# Altium project Connections.PrjPcb
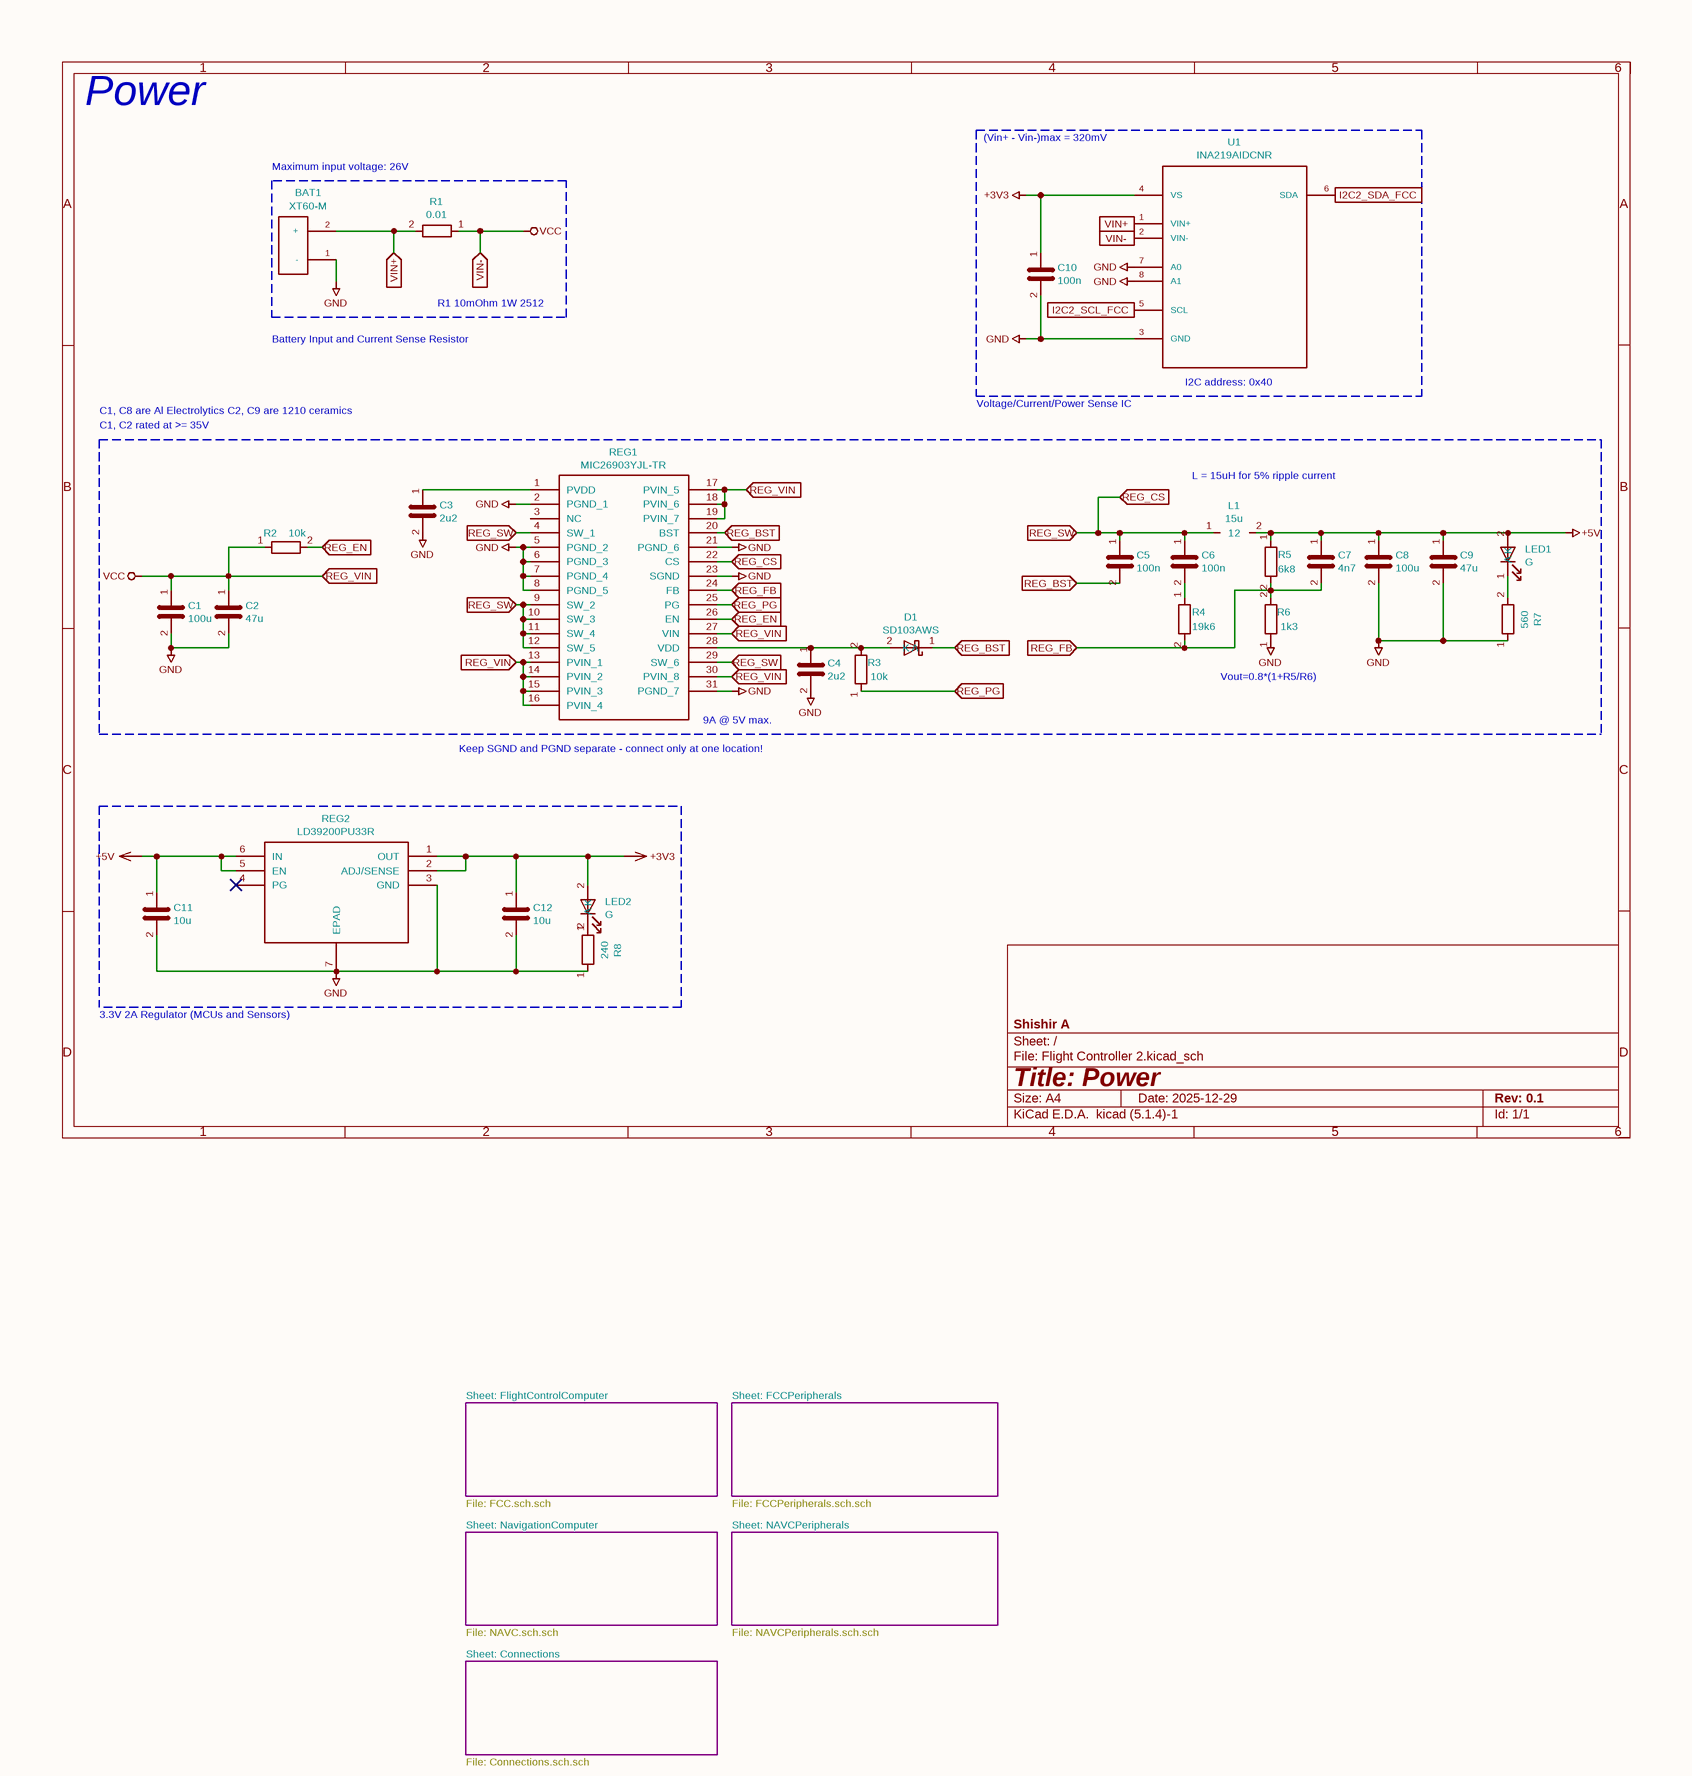
[diagram p0: Flight Controller 2.SchDoc]
6 sheets, 208 parts. Net scope: flat (ports and power ports of the same name join across sheets).
Sheets:
  Flight Controller 2.SchDoc
    FlightControlComputer = FCC.SchDoc
    NAVCPeripherals = NAVCPeripherals.SchDoc
    Connections = Connections.SchDoc
    FCCPeripherals = FCCPeripherals.SchDoc
    NavigationComputer = NAVC.SchDoc

## Sheet Flight Controller 2.SchDoc
size 297 x 209 mm

### Parts
BAT1  XT60-M  [AMASS_XT60-M]
C1  100u  [C_Elec_6.3x7.7]
C2  47u  [C_1210_3225Metric]
C3  2u2  [C_0805_2012Metric]
C4  2u2  [C_0805_2012Metric]
C5  100n  [C_0805_2012Metric]
C6  100n  [C_0805_2012Metric]
C7  4n7  [C_0805_2012Metric]
C8  100u  [C_Elec_6.3x7.7]
C9  47u  [C_1210_3225Metric]
C10  100n  [C_0402_1005Metric]
C11  10u  [C_0603_1608Metric]
C12  10u  [C_0603_1608Metric]
D1  SD103AWS  [D_SOD-323]
L1  15u  [INDPM135125X650N]
LED1  G  [LED_0603_1608Metric]
LED2  G  [LED_0603_1608Metric]
R1  0.01  [R_2512_6332Metric]
R2  10k  [R_0805_2012Metric]
R3  10k  [R_0805_2012Metric]
R4  19k6  [R_0805_2012Metric]
R5  6k8  [R_0805_2012Metric]
R6  1k3  [R_0805_2012Metric]
R7  560  [R_0603_1608Metric]
R8  240  [R_0603_1608Metric]
REG1  MIC26903YJL-TR  [MIC24054YJLTR]
REG2  LD39200PU33R  [SON95P300X300X100-7N-D]
U1  INA219AIDCNR  [SOT65P280X145-8N]

### Sub-sheets
Connections = Connections.SchDoc: no entries
FCCPeripherals = FCCPeripherals.SchDoc: no entries
FlightControlComputer = FCC.SchDoc: no entries
NAVCPeripherals = NAVCPeripherals.SchDoc: no entries
NavigationComputer = NAVC.SchDoc: no entries

### Ports
I2C2_SCL_FCC (in), I2C2_SDA_FCC (in), REG_BST (in), REG_CS (in), REG_EN (in), REG_FB (in), REG_PG (in), REG_SW (in), REG_VIN (in), VIN+ (in), VIN- (in)

### Nets
+3V3: C10.1 C12.1 LED2.2(A) REG2.1(OUT) REG2.2(ADJ/SENSE) U1.4(VS)
+5V: C7.1 C8.1 C9.1 C11.1 L1.2 LED1.2(A) R5.1 REG2.5(EN) REG2.6(IN)
GND: BAT1.1(-) C1.2 C2.2 C3.2 C4.2 C8.2 C9.2 C10.2 C11.2 C12.2 R6.1 R7.1 R8.1 REG1.2(PGND_1) REG1.5(PGND_2) REG1.6(PGND_3) REG1.7(PGND_4) REG1.8(PGND_5) REG1.21(PGND_6) REG1.23(SGND) REG1.31(PGND_7) REG2.3(GND) REG2.7(EPAD) U1.3(GND) U1.6(SDA) U1.7(A0) U1.8(A1) ; port I2C2_SDA_FCC
VCC: C1.1 C2.1 R1.1 R2.1 REG1.13(PVIN_1) REG1.14(PVIN_2) REG1.15(PVIN_3) REG1.16(PVIN_4) REG1.17(PVIN_5) REG1.18(PVIN_6) REG1.19(PVIN_7) REG1.27(VIN) REG1.30(PVIN_8) U1.2(VIN-) ; port REG_VIN, port VIN-
I2C2_SCL_FCC: U1.5(SCL) ; port I2C2_SCL_FCC
REG_BST: C5.2 D1.1(K) REG1.20(BST) ; port REG_BST
REG_CS: C5.1 C6.1 L1.1 REG1.4(SW_1) REG1.9(SW_2) REG1.10(SW_3) REG1.11(SW_4) REG1.12(SW_5) REG1.22(CS) REG1.29(SW_6) ; port REG_SW, port REG_CS
REG_EN: R2.2 REG1.26(EN) ; port REG_EN
REG_FB: C7.2 R4.2 R5.2 R6.2 REG1.24(FB) ; port REG_FB
REG_PG: R3.1 REG1.25(PG) ; port REG_PG
VIN+: BAT1.2(+) R1.2 U1.1(VIN+) ; port VIN+
NetC3_1: C3.1 REG1.1(PVDD)
NetC4_1: C4.1 D1.2(A) R3.2 REG1.28(VDD)
NetC6_2: C6.2 R4.1
NetLED1_1: LED1.1(K) R7.2
NetLED2_1: LED2.1(K) R8.2

Not connected (* = marked no-connect by the designer): REG1 3(NC); REG2 4(PG)*

### Notes on the sheet
- Power
- (Vin+ - Vin-)max = 320mV
- Maximum input voltage: 26V
- Battery Input and
  Current Sense Resistor
- R1 10mOhm 1W 2512
- C1, C8 are Al Electrolytics
  C2, C9 are 1210 ceramics
- C1, C2 rated at >= 35V
- Voltage/Current/Power Sense IC
- (near U1) I2C address: 0x40
- L = 15uH for 5% ripple current
- Vout=0.8*(1+R5/R6)
- (near REG1) Keep SGND and PGND separate - connect only at one location!
- (near REG1) 9A @ 5V max.
- 3.3V 2A Regulator (MCUs and Sensors)
- Sheet: FlightControlComputer
- Sheet: FCCPeripherals
- File: FCC.sch.sch
- File: FCCPeripherals.sch.sch
- Sheet: NavigationComputer
- Sheet: NAVCPeripherals
- Sheet: Connections
- File: NAVC.sch.sch
- File: NAVCPeripherals.sch.sch
- File: Connections.sch.sch
- 1
- 2
- 3
- 4
- 5
- 6
- A
- B
- C
- D
- Title: Power
- File: Flight Controller 2.kicad_sch
- Sheet: /
- Shishir A
- KiCad E.D.A.  kicad (5.1.4)-1
- Size: A4
- Date: 2025-12-29
- Rev: 0.1
- Id: 1/1

### Library data of the parts
BAT1 = XT60-M_2: Field4: None; Field6: Unavailable; Field7: AMASS; Field5: XT60-M; Value: XT60-M; Footprint: XT60-M:AMASS_XT60-M
C1-C12 = C
  C1: Value: 100u; Footprint: Capacitor_SMD:C_Elec_6.3x7.7; Supplier 1: DigiKey; Supplier Part Number 1: P124788CT-ND
  C2: Value: 47u; Footprint: Capacitor_SMD:C_1210_3225Metric; Supplier 1: DigiKey; Supplier Part Number 1: 587-6141-1-ND
  C3 C4: Value: 2u2; Footprint: Capacitor_SMD:C_0805_2012Metric
  C5 C6: Value: 100n; Footprint: Capacitor_SMD:C_0805_2012Metric
  C7: Value: 4n7; Footprint: Capacitor_SMD:C_0805_2012Metric
  C8: Value: 100u; Footprint: Capacitor_SMD:C_Elec_6.3x7.7
  C9: Value: 47u; Footprint: Capacitor_SMD:C_1210_3225Metric
  C10: Value: 100n; Footprint: Capacitor_SMD:C_0402_1005Metric
  C11 C12: Value: 10u; Footprint: Capacitor_SMD:C_0603_1608Metric
D1 = D_Schottky: Value: SD103AWS; Footprint: Diode_SMD:D_SOD-323
L1 = L: Value: 15u; Footprint: SRP1265A-150M:INDPM135125X650N; Supplier: DigiKey; Supplier Part Number: SRP1265A-150MCT-ND; Supplier 1: DigiKey; Supplier Part Number 1: SRP1265A-150MCT-ND
LED1 LED2 = LED: Value: G; Footprint: LED_SMD:LED_0603_1608Metric
R1-R8 = R
  R1: Value: 0.01; Footprint: Resistor_SMD:R_2512_6332Metric
  R2 R3: Value: 10k; Footprint: Resistor_SMD:R_0805_2012Metric
  R4: Value: 19k6; Footprint: Resistor_SMD:R_0805_2012Metric
  R5: Value: 6k8; Footprint: Resistor_SMD:R_0805_2012Metric
  R6: Value: 1k3; Footprint: Resistor_SMD:R_0805_2012Metric
  R7: Value: 560; Footprint: Resistor_SMD:R_0603_1608Metric
  R8: Value: 240; Footprint: Resistor_SMD:R_0603_1608Metric
REG1 = MIC26903YJL-TR: Manufacturer_Name: Micrel; Description: Switching Voltage Regulators 28V, 9A HyperLight Load  Synchronous DC/DC Buck Regulator SuperSwitcher IIG; Height: 2; Manufacturer_Part_Number: MIC26903YJL-TR; Mouser Part Number: 998-MIC26903YJLTR; Mouser Price/Stock: https://www.mouser.com/Search/Refine.aspx?Keyword=998-MIC26903YJLTR; Value: MIC26903YJL-TR; Footprint: MIC26903YJL-TR:MIC24054YJLTR
REG2 = LD39200PU33R: Manufacturer_Name: STMicroelectronics; Description: LDO Voltage Regulators 2 A high PSRR ultra low drop linear regulator with reverse current protection; Height: 1; Manufacturer_Part_Number: LD39200PU33R; Mouser Part Number: 511-LD39200PU33R; Mouser Price/Stock: https://www.mouser.com/Search/Refine.aspx?Keyword=511-LD39200PU33R; Value: LD39200PU33R; Footprint: LD39200PU33R:SON95P300X300X100-7N-D
U1 = INA219AIDCNR_2: Field4: 26-V, Bi-Directional, Zero-Drift, High-Side, I2C Out Current/Power Monitor 8-SOT-23 -40 to 125; Field5: Texas Instruments; Field6: SOT-23 Texas Instruments; Field7: None; Field8: INA219AIDCNR; Value: INA219AIDCNR; Footprint: INA219AIDCNR:SOT65P280X145-8N

## Sheet FCC.SchDoc
size 297 x 209 mm
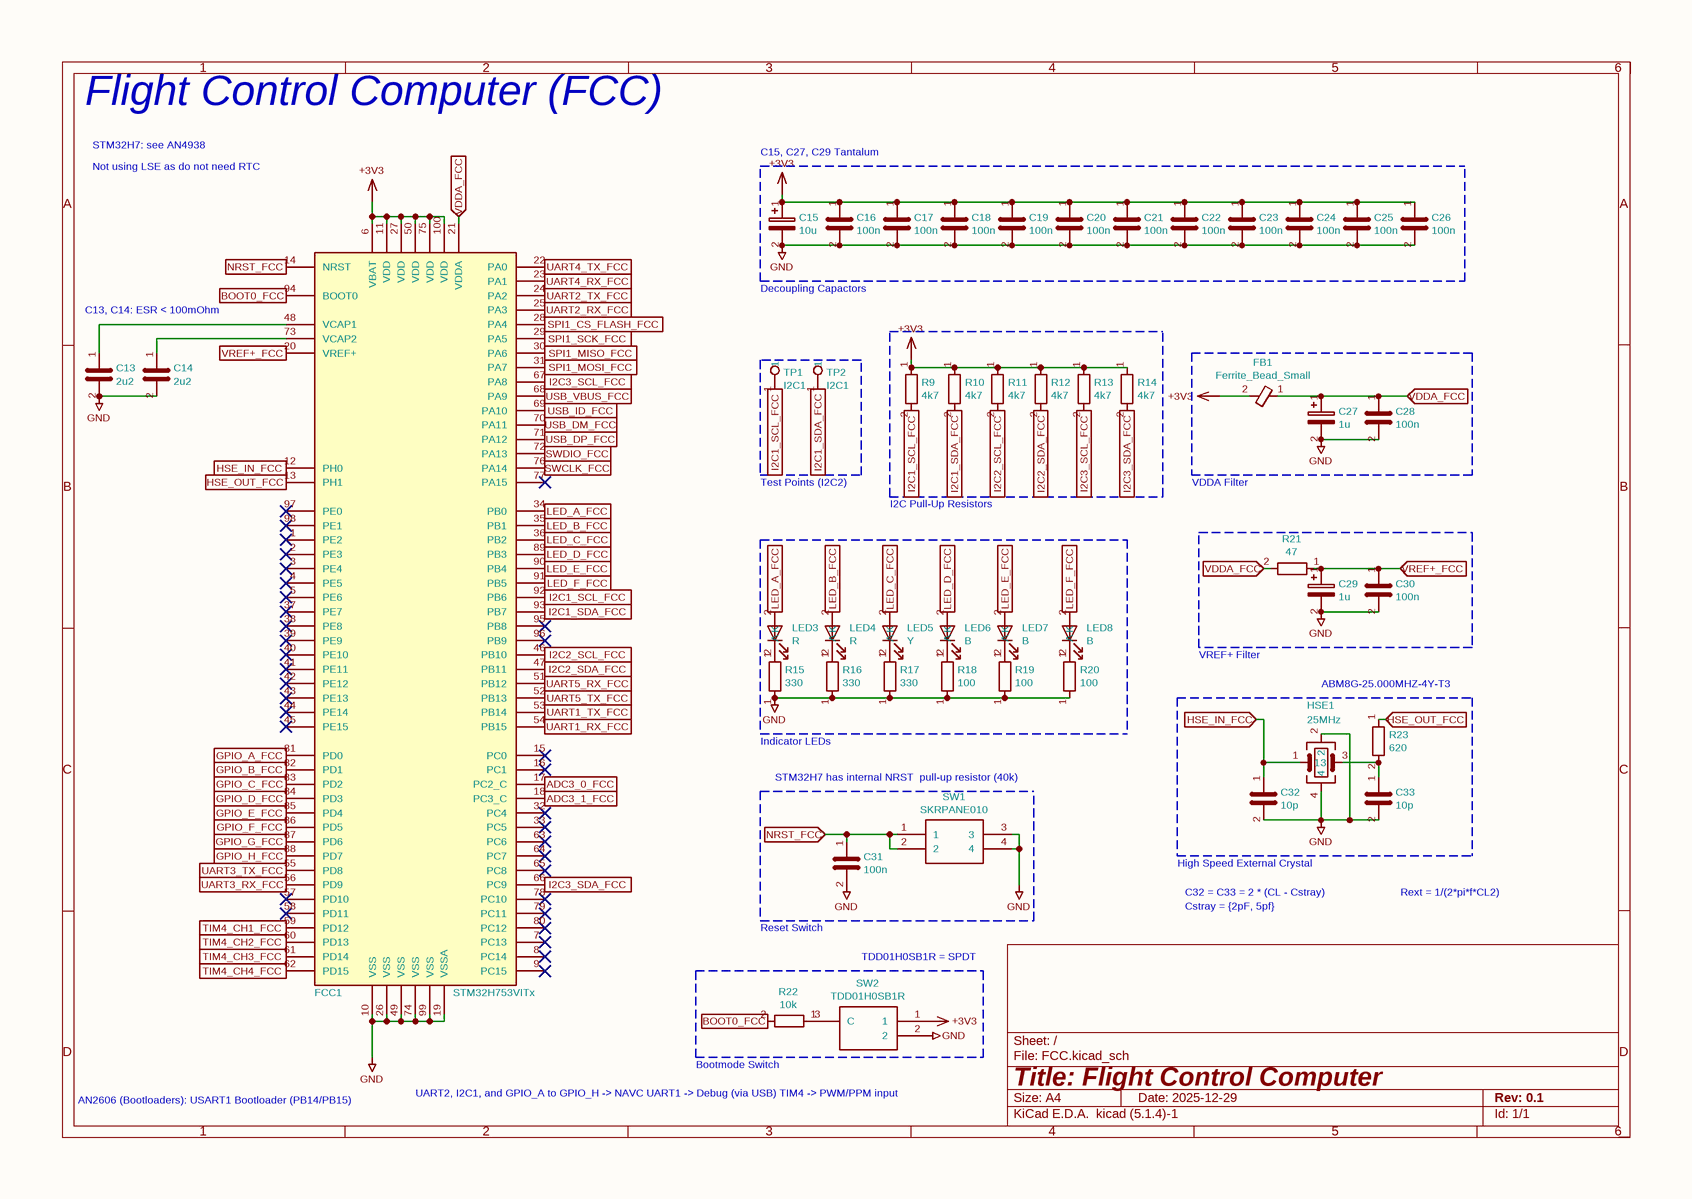
[diagram p1: FCC.SchDoc]

### Parts
C13  2u2  [C_0603_1608Metric]
C14  2u2  [C_0603_1608Metric]
C15  10u  [C_0603_1608Metric]
C16  100n  [C_0402_1005Metric]
C17  100n  [C_0402_1005Metric]
C18  100n  [C_0402_1005Metric]
C19  100n  [C_0402_1005Metric]
C20  100n  [C_0402_1005Metric]
C21  100n  [C_0402_1005Metric]
C22  100n  [C_0402_1005Metric]
C23  100n  [C_0402_1005Metric]
C24  100n  [C_0402_1005Metric]
C25  100n  [C_0402_1005Metric]
C26  100n  [C_0402_1005Metric]
C27  1u  [C_0603_1608Metric]
C28  100n  [C_0402_1005Metric]
C29  1u  [C_0603_1608Metric]
C30  100n  [C_0402_1005Metric]
C31  100n  [C_0402_1005Metric]
C32  10p  [C_0402_1005Metric]
C33  10p  [C_0402_1005Metric]
FB1  Ferrite_Bead_Small  [L_0402_1005Metric]
FCC1  STM32H753VITx  [LQFP-100_14x14mm_P0.5mm]
HSE1  25MHz  [Crystal_SMD_Abracon_ABM8G-4Pin_3.2x2.5mm]
LED3  R  [LED_0603_1608Metric]
LED4  R  [LED_0603_1608Metric]
LED5  Y  [LED_0603_1608Metric]
LED6  B  [LED_0603_1608Metric]
LED7  B  [LED_0603_1608Metric]
LED8  B  [LED_0603_1608Metric]
R9  4k7  [R_0402_1005Metric]
R10  4k7  [R_0402_1005Metric]
R11  4k7  [R_0402_1005Metric]
R12  4k7  [R_0402_1005Metric]
R13  4k7  [R_0402_1005Metric]
R14  4k7  [R_0402_1005Metric]
R15  330  [R_0603_1608Metric]
R16  330  [R_0603_1608Metric]
R17  330  [R_0603_1608Metric]
R18  100  [R_0603_1608Metric]
R19  100  [R_0603_1608Metric]
R20  100  [R_0603_1608Metric]
R21  47  [R_0402_1005Metric]
R22  10k  [R_0402_1005Metric]
R23  620  [R_0603_1608Metric]
SW1  SKRPANE010  [SKRPADE010]
SW2  TDD01H0SB1R  [SOT175P420X230-3N]
TP1  I2C1  [TestPoint_Pad_D1.5mm]
TP2  I2C1  [TestPoint_Pad_D1.5mm]

### Blocks framed on the sheet
C15, C27, C29 Tantalum: C15-C26
ABM8G-25.000MHZ-4Y-T3: C32 C33 HSE1 R23
STM32H7 has internal NRST / pull-up resistor (40k): C31 SW1
TDD01H0SB1R = SPDT: R22 SW2

### Ports
ADC3_0_FCC (in), ADC3_1_FCC (in), BOOT0_FCC (in), GPIO_A_FCC (in), GPIO_B_FCC (in), GPIO_C_FCC (in), GPIO_D_FCC (in), GPIO_E_FCC (in), GPIO_F_FCC (in), GPIO_G_FCC (in), GPIO_H_FCC (in), HSE_IN_FCC (in), HSE_OUT_FCC (in), I2C1_SCL_FCC (in), I2C1_SDA_FCC (in), I2C2_SCL_FCC (in), I2C2_SDA_FCC (in), I2C3_SCL_FCC (in), I2C3_SDA_FCC (in), LED_A_FCC (in), LED_B_FCC (in), LED_C_FCC (in), LED_D_FCC (in), LED_E_FCC (in), LED_F_FCC (in), NRST_FCC (in), SPI1_CS_FLASH_FCC (in), SPI1_MISO_FCC (in), SPI1_MOSI_FCC (in), SPI1_SCK_FCC (in), SWCLK_FCC (in), SWDIO_FCC (in), TIM4_CH1_FCC (in), TIM4_CH2_FCC (in), TIM4_CH3_FCC (in), TIM4_CH4_FCC (in), UART1_RX_FCC (in), UART1_TX_FCC (in), UART2_RX_FCC (in), UART2_TX_FCC (in), UART3_RX_FCC (in), UART3_TX_FCC (in), UART4_RX_FCC (in), UART4_TX_FCC (in), UART5_RX_FCC (in), UART5_TX_FCC (in), USB_DM_FCC (in), USB_DP_FCC (in), USB_ID_FCC (in), USB_VBUS_FCC (in), VDDA_FCC (in), VREF+_FCC (in)

### Nets
+3V3: C15.1 C16.1 C17.1 C18.1 C19.1 C20.1 C21.1 C22.1 C23.1 C24.1 C25.1 C26.1 FB1.2 FCC1.6(VBAT) FCC1.11(VDD) FCC1.27(VDD) FCC1.50(VDD) FCC1.75(VDD) FCC1.100(VDD) R9.1 R10.1 R11.1 R12.1 R13.1 R14.1 SW2.1
GND: C13.2 C14.2 C15.2 C16.2 C17.2 C18.2 C19.2 C20.2 C21.2 C22.2 C23.2 C24.2 C25.2 C26.2 C27.2 C28.2 C29.2 C30.2 C31.2 C32.2 C33.2 FCC1.10(VSS) FCC1.19(VSSA) FCC1.26(VSS) FCC1.47(PB11) FCC1.49(VSS) FCC1.74(VSS) FCC1.99(VSS) HSE1.2 HSE1.4 R12.2 R15.1 R16.1 R17.1 R18.1 R19.1 R20.1 SW1.3 SW1.4 SW2.2 ; port I2C2_SDA_FCC
ADC3_0_FCC: FCC1.17(PC2_C) ; port ADC3_0_FCC
ADC3_1_FCC: FCC1.18(PC3_C) ; port ADC3_1_FCC
BOOT0_FCC: FCC1.94(BOOT0) R22.2 ; port BOOT0_FCC
GPIO_A_FCC: FCC1.81(PD0) ; port GPIO_A_FCC
GPIO_B_FCC: FCC1.82(PD1) ; port GPIO_B_FCC
GPIO_C_FCC: FCC1.83(PD2) ; port GPIO_C_FCC
GPIO_D_FCC: FCC1.84(PD3) ; port GPIO_D_FCC
GPIO_E_FCC: FCC1.85(PD4) ; port GPIO_E_FCC
GPIO_F_FCC: FCC1.86(PD5) ; port GPIO_F_FCC
GPIO_G_FCC: FCC1.87(PD6) ; port GPIO_G_FCC
GPIO_H_FCC: FCC1.88(PD7) ; port GPIO_H_FCC
HSE_IN_FCC: C32.1 FCC1.12(PH0) HSE1.1 ; port HSE_IN_FCC
HSE_OUT_FCC: FCC1.13(PH1) R23.1 ; port HSE_OUT_FCC
I2C1_SCL_FCC: FCC1.92(PB6) R9.2 TP1.1 ; port I2C1_SCL_FCC
I2C1_SDA_FCC: FCC1.93(PB7) R10.2 TP2.1 ; port I2C1_SDA_FCC
I2C2_SCL_FCC: FCC1.46(PB10) R11.2 ; port I2C2_SCL_FCC
I2C3_SCL_FCC: FCC1.67(PA8) R13.2 ; port I2C3_SCL_FCC
I2C3_SDA_FCC: FCC1.66(PC9) R14.2 ; port I2C3_SDA_FCC
LED_A_FCC: FCC1.34(PB0) LED3.2(A) ; port LED_A_FCC
LED_B_FCC: FCC1.35(PB1) LED4.2(A) ; port LED_B_FCC
LED_C_FCC: FCC1.36(PB2) LED5.2(A) ; port LED_C_FCC
LED_D_FCC: FCC1.89(PB3) LED6.2(A) ; port LED_D_FCC
LED_E_FCC: FCC1.90(PB4) LED7.2(A) ; port LED_E_FCC
LED_F_FCC: FCC1.91(PB5) LED8.2(A) ; port LED_F_FCC
NRST_FCC: C31.1 FCC1.14(NRST) SW1.1 SW1.2 ; port NRST_FCC
SPI1_CS_FLASH_FCC: FCC1.28(PA4) ; port SPI1_CS_FLASH_FCC
SPI1_MISO_FCC: FCC1.30(PA6) ; port SPI1_MISO_FCC
SPI1_MOSI_FCC: FCC1.31(PA7) ; port SPI1_MOSI_FCC
SPI1_SCK_FCC: FCC1.29(PA5) ; port SPI1_SCK_FCC
SWCLK_FCC: FCC1.76(PA14) ; port SWCLK_FCC
SWDIO_FCC: FCC1.72(PA13) ; port SWDIO_FCC
TIM4_CH1_FCC: FCC1.59(PD12) ; port TIM4_CH1_FCC
TIM4_CH2_FCC: FCC1.60(PD13) ; port TIM4_CH2_FCC
TIM4_CH3_FCC: FCC1.61(PD14) ; port TIM4_CH3_FCC
TIM4_CH4_FCC: FCC1.62(PD15) ; port TIM4_CH4_FCC
UART1_RX_FCC: FCC1.54(PB15) ; port UART1_RX_FCC
UART1_TX_FCC: FCC1.53(PB14) ; port UART1_TX_FCC
UART2_RX_FCC: FCC1.25(PA3) ; port UART2_RX_FCC
UART2_TX_FCC: FCC1.24(PA2) ; port UART2_TX_FCC
UART3_RX_FCC: FCC1.56(PD9) ; port UART3_RX_FCC
UART3_TX_FCC: FCC1.55(PD8) ; port UART3_TX_FCC
UART4_RX_FCC: FCC1.23(PA1) ; port UART4_RX_FCC
UART4_TX_FCC: FCC1.22(PA0) ; port UART4_TX_FCC
UART5_RX_FCC: FCC1.51(PB12) ; port UART5_RX_FCC
UART5_TX_FCC: FCC1.52(PB13) ; port UART5_TX_FCC
USB_DM_FCC: FCC1.70(PA11) ; port USB_DM_FCC
USB_DP_FCC: FCC1.71(PA12) ; port USB_DP_FCC
USB_ID_FCC: FCC1.69(PA10) ; port USB_ID_FCC
USB_VBUS_FCC: FCC1.68(PA9) ; port USB_VBUS_FCC
VDDA_FCC: C27.1 C28.1 FB1.1 FCC1.21(VDDA) R21.2 ; port VDDA_FCC
VREF+_FCC: C29.1 C30.1 FCC1.20(VREF+) R21.1 ; port VREF+_FCC
NetC13_1: C13.1 FCC1.48(VCAP1)
NetC14_1: C14.1 FCC1.73(VCAP2)
NetC33_1: C33.1 HSE1.3 R23.2
NetLED3_1: LED3.1(K) R15.2
NetLED4_1: LED4.1(K) R16.2
NetLED5_1: LED5.1(K) R17.2
NetLED6_1: LED6.1(K) R18.2
NetLED7_1: LED7.1(K) R19.2
NetLED8_1: LED8.1(K) R20.2
NetR22_1: R22.1 SW2.3(C)

Not connected (* = marked no-connect by the designer): FCC1 1(PE2)* 2(PE3)* 3(PE4)* 4(PE5)* 5(PE6)* 7(PC13)* 8(PC14)* 9(PC15)* 15(PC0)* 16(PC1)* 32(PC4)* 33(PC5)* 37(PE7)* 38(PE8)* 39(PE9)* 40(PE10)* 41(PE11)* 42(PE12)* 43(PE13)* 44(PE14)* 45(PE15)* 57(PD10)* 58(PD11)* 63(PC6)* 64(PC7)* 65(PC8)* 77(PA15)* 78(PC10)* 79(PC11)* 80(PC12)* 95(PB8)* 96(PB9)* 97(PE0)* 98(PE1)*

### Notes on the sheet
- Flight Control Computer (FCC)
- Not using LSE as do not need RTC
- STM32H7: see AN4938
- C13, C14: ESR < 100mOhm
- Decoupling Capactors
- Test Points (I2C2)
- I2C Pull-Up Resistors
- VDDA Filter
- VREF+ Filter
- Indicator LEDs
- Reset Switch
- High Speed External Crystal
- C32 = C33 = 2 * (CL - Cstray)
- Cstray = {2pF, 5pf}
- Rext = 1/(2*pi*f*CL2)
- (near R22) Bootmode Switch
- AN2606 (Bootloaders): USART1 Bootloader (PB14/PB15)
- UART2, I2C1, and GPIO_A to GPIO_H -> NAVC
  UART1 -> Debug (via USB)
  TIM4 -> PWM/PPM input
- 1
- 2
- 3
- 4
- 5
- 6
- A
- B
- C
- D
- Title: Flight Control Computer
- File: FCC.kicad_sch
- Sheet: /
- KiCad E.D.A.  kicad (5.1.4)-1
- Size: A4
- Date: 2025-12-29
- Rev: 0.1
- Id: 1/1

### Library data of the parts
C13 C14 C16-C26 C28 C30-C33 = C
  C13 C14: Value: 2u2; Footprint: Capacitor_SMD:C_0603_1608Metric
  C16-C26 C28 C30 C31: Value: 100n; Footprint: Capacitor_SMD:C_0402_1005Metric
  C32 C33: Value: 10p; Footprint: Capacitor_SMD:C_0402_1005Metric
C15 C27 C29 = CP-Device: Footprint: Capacitor_SMD:C_0603_1608Metric
  C15: Value: 10u
  C27 C29: Value: 1u
FB1 = Ferrite_Bead_Small-Device: Value: Ferrite_Bead_Small; Footprint: Inductor_SMD:L_0402_1005Metric
FCC1 = STM32H753VITx-MCU_ST_STM32H7: Value: STM32H753VITx; Footprint: Package_QFP:LQFP-100_14x14mm_P0.5mm
HSE1 = Crystal_GND24: Value: 25MHz; Footprint: Crystal:Crystal_SMD_Abracon_ABM8G-4Pin_3.2x2.5mm
LED3-LED8 = LED: Footprint: LED_SMD:LED_0603_1608Metric
  LED3 LED4: Value: R
  LED5: Value: Y
  LED6-LED8: Value: B
R9-R23 = R
  R9-R14: Value: 4k7; Footprint: Resistor_SMD:R_0402_1005Metric
  R15-R17: Value: 330; Footprint: Resistor_SMD:R_0603_1608Metric
  R18-R20: Value: 100; Footprint: Resistor_SMD:R_0603_1608Metric
  R21: Value: 47; Footprint: Resistor_SMD:R_0402_1005Metric
  R22: Value: 10k; Footprint: Resistor_SMD:R_0402_1005Metric
  R23: Value: 620; Footprint: Resistor_SMD:R_0603_1608Metric
SW1 = SKRPANE010: Manufacturer_Name: ALPS; Height: 2; Manufacturer_Part_Number: SKRPANE010; Mouser Part Number: 688-SKRPANE010; Mouser Price/Stock: https://www.mouser.com/Search/Refine.aspx?Keyword=688-SKRPANE010; Value: SKRPANE010; Footprint: SKRPANE010:SKRPADE010
SW2 = TDD01H0SB1R: Manufacturer_Name: C & K COMPONENTS; Height: 2.3; Manufacturer_Part_Number: TDD01H0SB1R; Mouser Part Number: 611-TDD01H0SB1R; Mouser Price/Stock: https://www.mouser.com/Search/Refine.aspx?Keyword=611-TDD01H0SB1R; Value: TDD01H0SB1R; Footprint: TDD01H0SB1R:SOT175P420X230-3N
TP1 TP2 = TestPoint: Value: I2C1; Footprint: TestPoint:TestPoint_Pad_D1.5mm

## Sheet NAVCPeripherals.SchDoc
size 297 x 209 mm
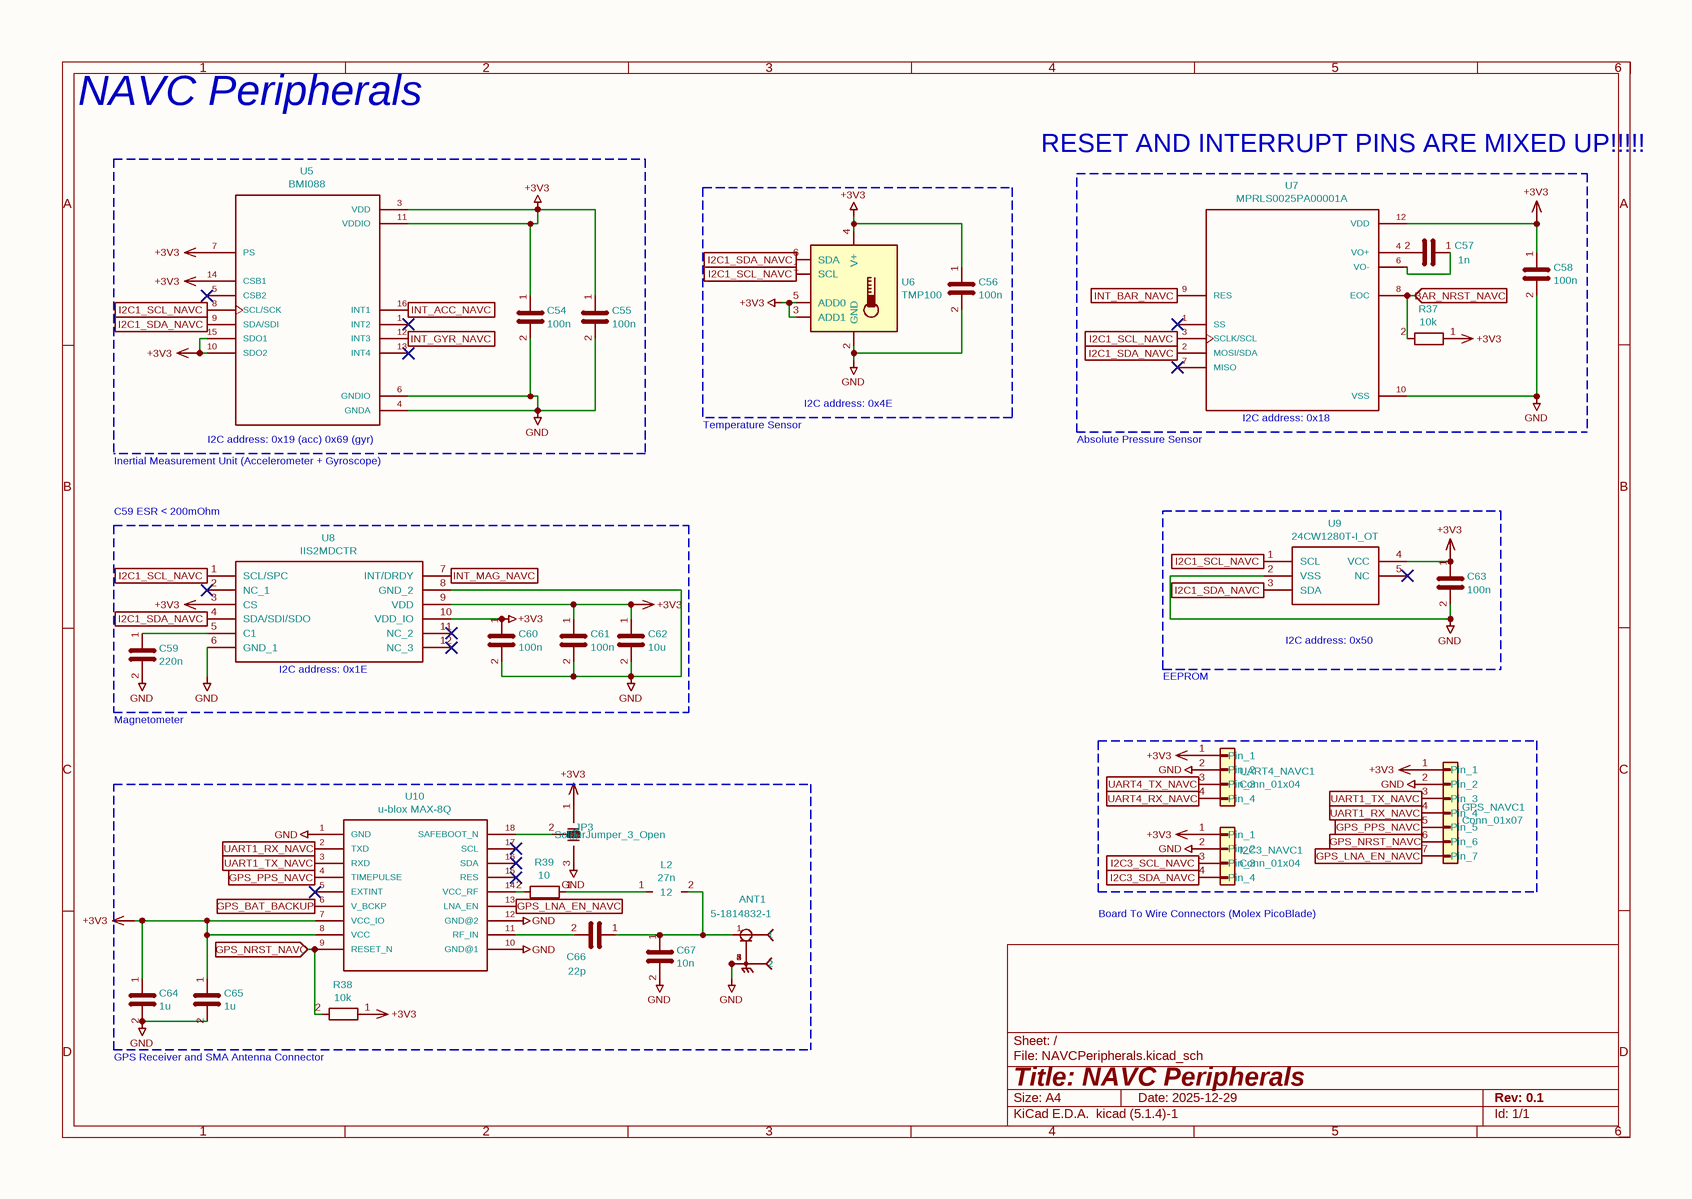
[diagram p2: NAVCPeripherals.SchDoc]

### Parts
ANT1  5-1814832-1  [TE_5-1814832-1]
C54  100n  [C_0402_1005Metric]
C55  100n  [C_0402_1005Metric]
C56  100n  [C_0402_1005Metric]
C57  1n  [C_0402_1005Metric]
C58  100n  [C_0402_1005Metric]
C59  220n  [C_0603_1608Metric]
C60  100n  [C_0402_1005Metric]
C61  100n  [C_0402_1005Metric]
C62  10u  [C_0603_1608Metric]
C63  100n  [C_0402_1005Metric]
C64  1u  [C_0603_1608Metric]
C65  1u  [C_0603_1608Metric]
C66  22p  [C_0402_1005Metric]
C67  10n  [C_0402_1005Metric]
GPS_NAVC1  Conn_01x07  [Molex_PicoBlade_53048-0710_1x07_P1.25mm_Horizontal]
I2C3_NAVC1  Conn_01x04  [Molex_PicoBlade_53048-0410_1x04_P1.25mm_Horizontal]
JP3  SolderJumper_3_Open  [SolderJumper-3_P1.3mm_Open_RoundedPad1.0x1.5mm]
L2  27n  [L_0402_1005Metric]
R37  10k  [R_0402_1005Metric]
R38  10k  [R_0402_1005Metric]
R39  10  [R_0402_1005Metric]
U5  BMI088  [PQFN50P450X300X100-16N]
U6  TMP100  [SOT-23-6]
U7  MPRLS0025PA00001A  [XDCR_MPRLS0025PA00001A]
U8  IIS2MDCTR  [IIS2MDCTR]
U9  24CW1280T-I_OT  [SOT95P280X145-5N]
U10  u-blox MAX-8Q  [GPS18P-SMD-1.1-10X9.6MM]
UART4_NAVC1  Conn_01x04  [Molex_PicoBlade_53048-0410_1x04_P1.25mm_Horizontal]

### Blocks framed on the sheet
I2C address: 0x19 (acc) 0x69 (gyr): C54 C55 U5
I2C address: 0x4E: C56 U6
I2C address: 0x18: C57 C58 R37 U7
I2C address: 0x50: C63 U9

### Ports
BAR_NRST_NAVC (in), GPS_BAT_BACKUP (in), GPS_LNA_EN_NAVC (in), GPS_NRST_NAVC (in), GPS_PPS_NAVC (in), I2C1_SCL_NAVC (in), I2C1_SDA_NAVC (in), I2C3_SCL_NAVC (in), I2C3_SDA_NAVC (in), INT_ACC_NAVC (in), INT_BAR_NAVC (in), INT_GYR_NAVC (in), INT_MAG_NAVC (in), UART1_RX_NAVC (in), UART1_TX_NAVC (in), UART4_RX_NAVC (in), UART4_TX_NAVC (in)

### Nets
+3V3: C54.1 C55.1 C56.1 C58.1 C60.1 C61.1 C62.1 C63.1 C64.1 C65.1 GPS_NAVC1.1(Pin_1) I2C3_NAVC1.1(Pin_1) JP3.1(A) R37.1 R38.1 U5.3(VDD) U5.7(PS) U5.10(SDO2) U5.11(VDDIO) U5.14(CSB1) U5.15(SDO1) U6.3(ADD1) U6.4(V+) U6.5(ADD0) U7.12(VDD) U8.3(CS) U8.9(VDD) U8.10(VDD_IO) U9.4(VCC) U10.7(VCC_IO) U10.8(VCC) UART4_NAVC1.1(Pin_1)
GND: ANT1.2 ANT1.3(2) ANT1.4(2) ANT1.5(2) C54.2 C55.2 C56.2 C58.2 C59.2 C60.2 C61.2 C62.2 C63.2 C64.2 C65.2 C67.2 GPS_NAVC1.2(Pin_2) I2C3_NAVC1.2(Pin_2) JP3.3(B) U5.4(GNDA) U5.6(GNDIO) U6.2(GND) U7.10(VSS) U8.6(GND_1) U8.8(GND_2) U9.2(VSS) U10.1(GND) U10.10(GND@1) U10.12(GND@2) UART4_NAVC1.2(Pin_2)
BAR_NRST_NAVC: R37.2 U7.8(EOC) ; port BAR_NRST_NAVC
GPS_BAT_BACKUP: U10.6(V_BCKP) ; port GPS_BAT_BACKUP
GPS_LNA_EN_NAVC: GPS_NAVC1.7(Pin_7) U10.13(LNA_EN) ; port GPS_LNA_EN_NAVC
GPS_NRST_NAVC: GPS_NAVC1.6(Pin_6) R38.2 U10.9(RESET_N) ; port GPS_NRST_NAVC
GPS_PPS_NAVC: GPS_NAVC1.5(Pin_5) U10.4(TIMEPULSE) ; port GPS_PPS_NAVC
I2C1_SCL_NAVC: U5.8(SCL/SCK) U6.1(SCL) U7.3(SCLK/SCL) U8.1(SCL/SPC) U9.1(SCL) ; port I2C1_SCL_NAVC
I2C1_SDA_NAVC: U5.9(SDA/SDI) U6.6(SDA) U7.2(MOSI/SDA) U8.4(SDA/SDI/SDO) U9.3(SDA) ; port I2C1_SDA_NAVC
I2C3_SCL_NAVC: I2C3_NAVC1.3(Pin_3) ; port I2C3_SCL_NAVC
I2C3_SDA_NAVC: I2C3_NAVC1.4(Pin_4) ; port I2C3_SDA_NAVC
INT_ACC_NAVC: U5.16(INT1) ; port INT_ACC_NAVC
INT_BAR_NAVC: U7.9(RES) ; port INT_BAR_NAVC
INT_GYR_NAVC: U5.12(INT3) ; port INT_GYR_NAVC
INT_MAG_NAVC: U8.7(INT/DRDY) ; port INT_MAG_NAVC
UART1_RX_NAVC: GPS_NAVC1.4(Pin_4) U10.2(TXD) ; port UART1_RX_NAVC
UART1_TX_NAVC: GPS_NAVC1.3(Pin_3) U10.3(RXD) ; port UART1_TX_NAVC
UART4_RX_NAVC: UART4_NAVC1.4(Pin_4) ; port UART4_RX_NAVC
UART4_TX_NAVC: UART4_NAVC1.3(Pin_3) ; port UART4_TX_NAVC
NetANT1_1: ANT1.1 C66.1 C67.1 L2.2
NetC57_1: C57.1 U7.6(VO-)
NetC57_2: C57.2 U7.4(VO+)
NetC59_1: C59.1 U8.5(C1)
NetC66_2: C66.2 U10.11(RF_IN)
NetJP3_2: JP3.2(C) U10.18(SAFEBOOT_N)
NetL2_1: L2.1 R39.1
NetR39_2: R39.2 U10.14(VCC_RF)

Not connected (* = marked no-connect by the designer): U5 1(INT2)* 5(CSB2)* 13(INT4)*; U7 1(SS)* 7(MISO)*; U8 2(NC_1)* 11(NC_2)* 12(NC_3)*; U9 5(NC)*; U10 5(EXTINT)* 15(RES)* 16(SDA)* 17(SCL)*

### Notes on the sheet
- NAVC Peripherals
- RESET AND INTERRUPT PINS ARE MIXED UP!!!!!
- Temperature Sensor
- (near U5) Inertial Measurement Unit (Accelerometer + Gyroscope)
- (near U7) Absolute Pressure Sensor
- C59 ESR < 200mOhm
- (near U8) I2C address: 0x1E
- EEPROM
- (near C59) Magnetometer
- (near I2C3_NAVC1) Board To Wire Connectors
  (Molex PicoBlade)
- GPS Receiver and SMA Antenna Connector
- 1
- 2
- 3
- 4
- 5
- 6
- A
- B
- C
- D
- Title: NAVC Peripherals
- File: NAVCPeripherals.kicad_sch
- Sheet: /
- KiCad E.D.A.  kicad (5.1.4)-1
- Size: A4
- Date: 2025-12-29
- Rev: 0.1
- Id: 1/1

### Library data of the parts
ANT1 = 5-1814832-1_2: Field4: TE Connectivity; Field5: SMA/QMA socket 50 Ohm | TE Connectivity 518148321 _SMA/QMA socket 50 Ohm RF Connectors_.; Field6: 518148321; Field7: None; Field8: Unavailable; Field9: None; Value: 5-1814832-1; Footprint: 5-1814832-1:TE_5-1814832-1
C54-C67 = C
  C54-C56 C58 C60 C61 C63: Value: 100n; Footprint: Capacitor_SMD:C_0402_1005Metric
  C57: Value: 1n; Footprint: Capacitor_SMD:C_0402_1005Metric
  C59: Value: 220n; Footprint: Capacitor_SMD:C_0603_1608Metric
  C62: Value: 10u; Footprint: Capacitor_SMD:C_0603_1608Metric
  C64 C65: Value: 1u; Footprint: Capacitor_SMD:C_0603_1608Metric
  C66: Value: 22p; Footprint: Capacitor_SMD:C_0402_1005Metric
  C67: Value: 10n; Footprint: Capacitor_SMD:C_0402_1005Metric
JP3 = SolderJumper_3_Open-Jumper: Value: SolderJumper_3_Open; Footprint: Jumper:SolderJumper-3_P1.3mm_Open_RoundedPad1.0x1.5mm
L2 = L: Value: 27n; Footprint: Inductor_SMD:L_0402_1005Metric; Supplier 1: DigiKey; Supplier Part Number 1: LQW04AN27NJ00D-ND
R37-R39 = R: Footprint: Resistor_SMD:R_0402_1005Metric
  R37 R38: Value: 10k
  R39: Value: 10
U5 = BMI088_2: Field4: None; Field5: VFLGA-16 Bosch Sensortec; Field6: Bosch Sensortec; Field7: High-performance 6-axis inertial sensor _accelerometer + gyroscope_; Field8: Unavailable; Value: BMI088; Footprint: BMI088:PQFN50P450X300X100-16N
U7 = MPRLS0025PA00001A_2: Field4: Unavailable; Field5: Pressure Sensor 0psi to 25psi Absolute 12-Pin T/R; Field6: SMD-10 Honeywell; Field7: Honeywell Sensing; Field8: None; Value: MPRLS0025PA00001A; Footprint: MPRLS0025PA00001A:XDCR_MPRLS0025PA00001A
U8 = IIS2MDCTR: Manufacturer_Name: STMicroelectronics; Height: 0.7; Manufacturer_Part_Number: IIS2MDCTR; Mouser Part Number: 511-IIS2MDCTR; Mouser Price/Stock: https://www.mouser.com/Search/Refine.aspx?Keyword=511-IIS2MDCTR; Value: IIS2MDCTR; Footprint: IIS2MDCTR:IIS2MDCTR
U9 = 24CW1280T-I_OT: Manufacturer_Name: Microchip; Manufacturer_Part_Number: 24CW1280T-I/OT; Height: 1.45; Mouser Part Number: 579-24CW1280T-I/OT; Mouser Price/Stock: https://www.mouser.com/Search/Refine.aspx?Keyword=579-24CW1280T-I%2FOT; RS Part Number: 1871851; RS Price/Stock: http://uk.rs-online.com/web/p/products/1871851; Value: 24CW1280T-I_OT; Footprint: 24CW1280T-I_OT:SOT95P280X145-5N
U10 = MODULE-GPS-SMD-MAX-7Q-0(18P-9.6X10MM)_2: Field4: SMD-18 u-blox; Field5: SMD GPS Module;; Field6: Unavailable; Field8: None; Field7: MAX-7Q-0; Value: u-blox MAX-8Q; Footprint: MODULE-GPS-SMD-MAX-7Q-0_18P-9.6X10MM_:GPS18P-SMD-1.1-10X9.6MM
GPS_NAVC1 = Conn_01x07: Value: Conn_01x07; Footprint: Connector_Molex:Molex_PicoBlade_53048-0710_1x07_P1.25mm_Horizontal
I2C3_NAVC1 UART4_NAVC1 = Conn_01x04: Value: Conn_01x04; Footprint: Connector_Molex:Molex_PicoBlade_53048-0410_1x04_P1.25mm_Horizontal
U6 = TMP100: Value: TMP100; Footprint: Package_TO_SOT_SMD:SOT-23-6

## Sheet Connections.SchDoc
size 297 x 209 mm
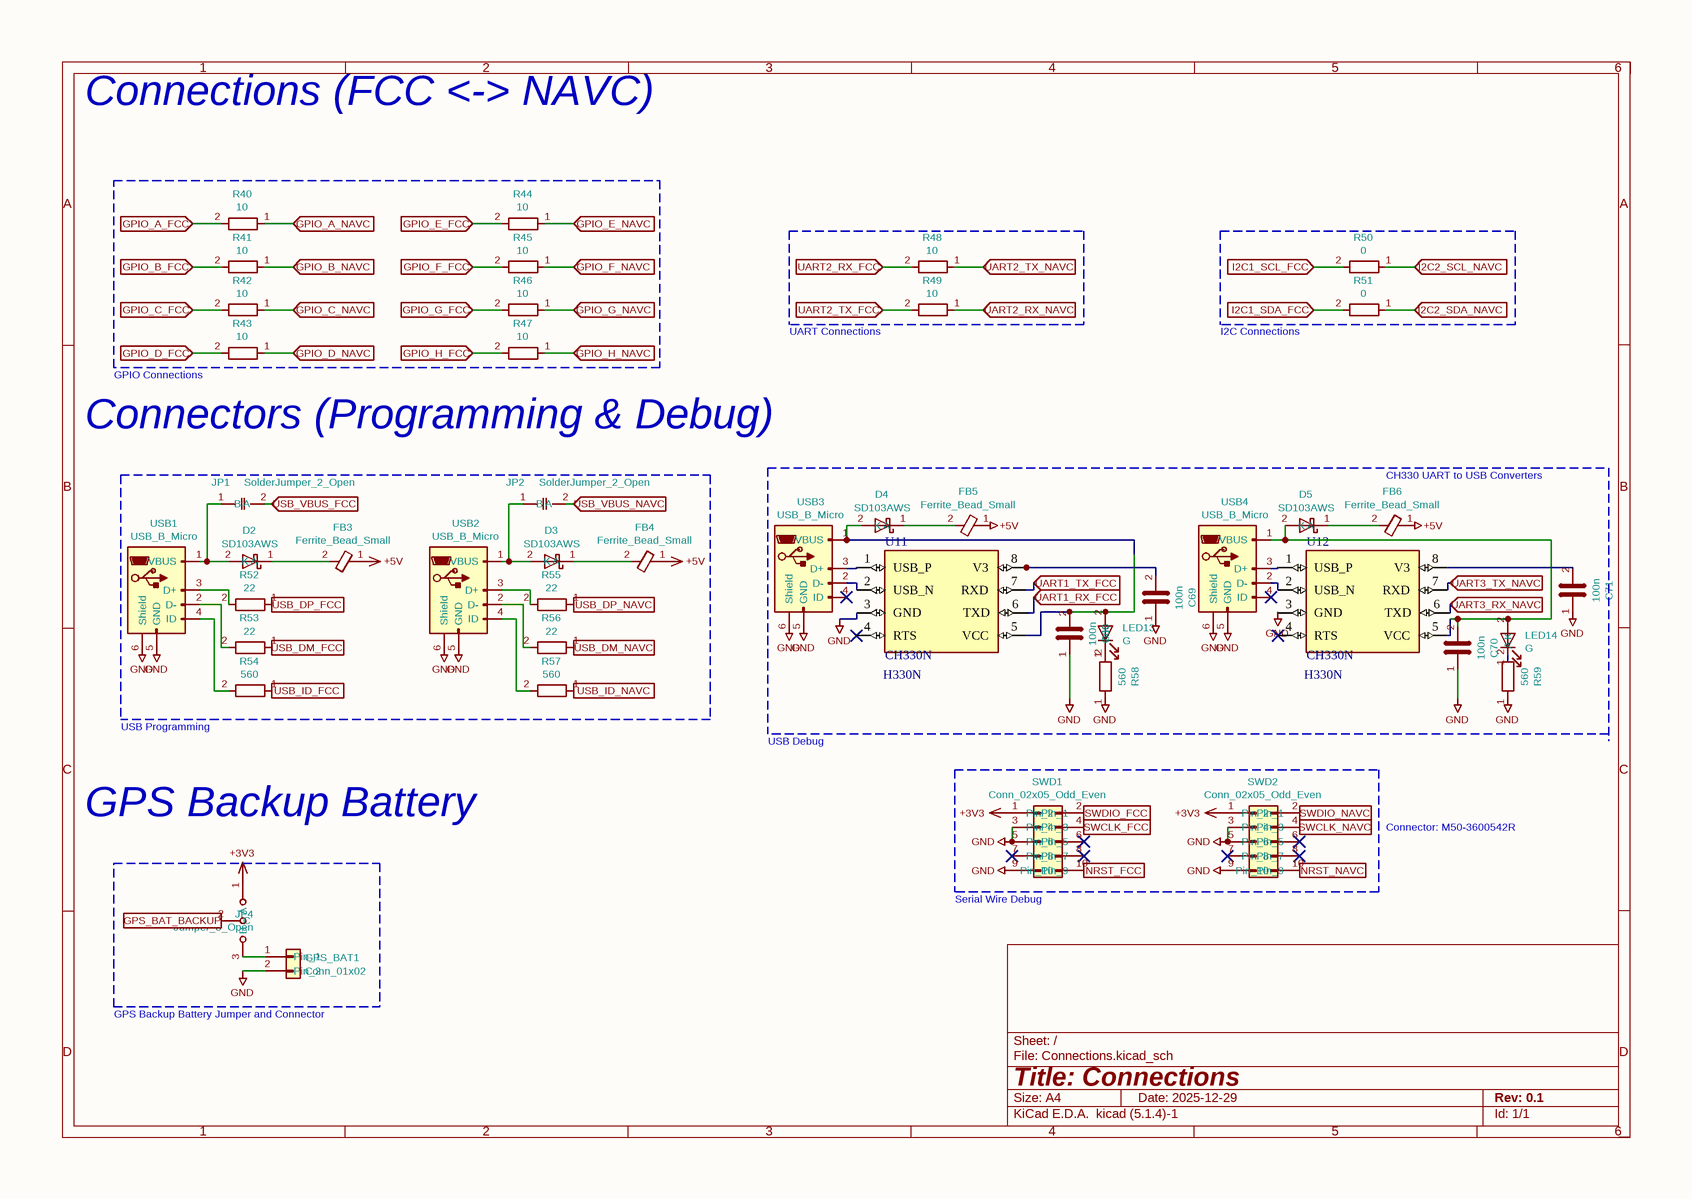
[diagram p3: Connections.SchDoc]

### Parts
C68  100n  [C_0402_1005Metric]
C69  100n  [C_0402_1005Metric]
C70  100n  [C_0402_1005Metric]
C71  100n  [C_0402_1005Metric]
D2  SD103AWS  [D_SOD-323]
D3  SD103AWS  [D_SOD-323]
D4  SD103AWS  [D_SOD-323]
D5  SD103AWS  [D_SOD-323]
FB3  Ferrite_Bead_Small  [L_0402_1005Metric]
FB4  Ferrite_Bead_Small  [L_0402_1005Metric]
FB5  Ferrite_Bead_Small  [L_0402_1005Metric]
FB6  Ferrite_Bead_Small  [L_0402_1005Metric]
GPS_BAT1  Conn_01x02  [Molex_PicoBlade_53048-0210_1x02_P1.25mm_Horizontal]
JP1  SolderJumper_2_Open  [SolderJumper-2_P1.3mm_Open_RoundedPad1.0x1.5mm]
JP2  SolderJumper_2_Open  [SolderJumper-2_P1.3mm_Open_RoundedPad1.0x1.5mm]
JP4  Jumper_3_Open  [SolderJumper-3_P1.3mm_Open_RoundedPad1.0x1.5mm]
LED13  G  [LED_0603_1608Metric]
LED14  G  [LED_0603_1608Metric]
R40  10  [R_0402_1005Metric]
R41  10  [R_0402_1005Metric]
R42  10  [R_0402_1005Metric]
R43  10  [R_0402_1005Metric]
R44  10  [R_0402_1005Metric]
R45  10  [R_0402_1005Metric]
R46  10  [R_0402_1005Metric]
R47  10  [R_0402_1005Metric]
R48  10  [R_0402_1005Metric]
R49  10  [R_0402_1005Metric]
R50  0  [R_0603_1608Metric]
R51  0  [R_0603_1608Metric]
R52  22  [R_0402_1005Metric]
R53  22  [R_0402_1005Metric]
R54  560  [R_0402_1005Metric]
R55  22  [R_0402_1005Metric]
R56  22  [R_0402_1005Metric]
R57  560  [R_0402_1005Metric]
R58  560  [R_0603_1608Metric]
R59  560  [R_0603_1608Metric]
SWD1  Conn_02x05_Odd_Even  [PinHeader_2x05_P1.27mm_Vertical_SMD]
SWD2  Conn_02x05_Odd_Even  [PinHeader_2x05_P1.27mm_Vertical_SMD]
U11  H330N  [8-SOIC]
U12  H330N  [8-SOIC]
USB1  USB_B_Micro  [USB_Micro-B_Wuerth_629105150521_CircularHoles]
USB2  USB_B_Micro  [USB_Micro-B_Wuerth_629105150521_CircularHoles]
USB3  USB_B_Micro  [USB_Micro-B_Wuerth_629105150521_CircularHoles]
USB4  USB_B_Micro  [USB_Micro-B_Wuerth_629105150521_CircularHoles]

### Ports
GPIO_A_FCC (in), GPIO_A_NAVC (in), GPIO_B_FCC (in), GPIO_B_NAVC (in), GPIO_C_FCC (in), GPIO_C_NAVC (in), GPIO_D_FCC (in), GPIO_D_NAVC (in), GPIO_E_FCC (in), GPIO_E_NAVC (in), GPIO_F_FCC (in), GPIO_F_NAVC (in), GPIO_G_FCC (in), GPIO_G_NAVC (in), GPIO_H_FCC (in), GPIO_H_NAVC (in), GPS_BAT_BACKUP (in), I2C1_SCL_FCC (in), I2C1_SDA_FCC (in), I2C2_SCL_NAVC (in), I2C2_SDA_NAVC (in), NRST_FCC (in), NRST_NAVC (in), SWCLK_FCC (in), SWCLK_NAVC (in), SWDIO_FCC (in), SWDIO_NAVC (in), UART1_RX_FCC (in), UART1_TX_FCC (in), UART2_RX_FCC (in), UART2_RX_NAVC (in), UART2_TX_FCC (in), UART2_TX_NAVC (in), UART3_RX_NAVC (in), UART3_TX_NAVC (in), USB_DM_FCC (in), USB_DM_NAVC (in), USB_DP_FCC (in), USB_DP_NAVC (in), USB_ID_FCC (in), USB_ID_NAVC (in), USB_VBUS_FCC (in), USB_VBUS_NAVC (in)

### Nets
+3V3: JP4.1(A) SWD1.1(Pin_1) SWD2.1(Pin_1)
+5V: FB3.1 FB4.1 FB5.1 FB6.1
GND: C68.1 C69.1 C70.1 C71.1 GPS_BAT1.2(Pin_2) R58.1 R59.1 SWD1.3(Pin_3) SWD1.5(Pin_5) SWD1.9(Pin_9) SWD2.3(Pin_3) SWD2.5(Pin_5) SWD2.9(Pin_9) U11.3(GND) USB1.5(GND) USB1.6(Shield) USB2.5(GND) USB2.6(Shield) USB3.5(GND) USB3.6(Shield) USB4.5(GND) USB4.6(Shield)
GPIO_A_FCC: R40.2 ; port GPIO_A_FCC
GPIO_A_NAVC: R40.1 ; port GPIO_A_NAVC
GPIO_B_FCC: R41.2 ; port GPIO_B_FCC
GPIO_B_NAVC: R41.1 ; port GPIO_B_NAVC
GPIO_C_FCC: R42.2 ; port GPIO_C_FCC
GPIO_C_NAVC: R42.1 ; port GPIO_C_NAVC
GPIO_D_FCC: R43.2 ; port GPIO_D_FCC
GPIO_D_NAVC: R43.1 ; port GPIO_D_NAVC
GPIO_E_FCC: R44.2 ; port GPIO_E_FCC
GPIO_E_NAVC: R44.1 ; port GPIO_E_NAVC
GPIO_F_FCC: R45.2 ; port GPIO_F_FCC
GPIO_F_NAVC: R45.1 ; port GPIO_F_NAVC
GPIO_G_FCC: R46.2 ; port GPIO_G_FCC
GPIO_G_NAVC: R46.1 ; port GPIO_G_NAVC
GPIO_H_FCC: R47.2 ; port GPIO_H_FCC
GPIO_H_NAVC: R47.1 ; port GPIO_H_NAVC
GPS_BAT_BACKUP: JP4.2(C) ; port GPS_BAT_BACKUP
I2C1_SCL_FCC: R50.2 ; port I2C1_SCL_FCC
I2C1_SDA_FCC: R51.2 ; port I2C1_SDA_FCC
I2C2_SCL_NAVC: R50.1 ; port I2C2_SCL_NAVC
I2C2_SDA_NAVC: R51.1 ; port I2C2_SDA_NAVC
NRST_FCC: SWD1.10(Pin_10) ; port NRST_FCC
NRST_NAVC: SWD2.10(Pin_10) ; port NRST_NAVC
SWCLK_FCC: SWD1.4(Pin_4) ; port SWCLK_FCC
SWCLK_NAVC: SWD2.4(Pin_4) ; port SWCLK_NAVC
SWDIO_FCC: SWD1.2(Pin_2) ; port SWDIO_FCC
SWDIO_NAVC: SWD2.2(Pin_2) ; port SWDIO_NAVC
UART1_RX_FCC: U11.6(TXD) ; port UART1_RX_FCC
UART1_TX_FCC: U11.7(RXD) ; port UART1_TX_FCC
UART2_RX_FCC: R48.2 ; port UART2_RX_FCC
UART2_RX_NAVC: R49.1 ; port UART2_RX_NAVC
UART2_TX_FCC: R49.2 ; port UART2_TX_FCC
UART2_TX_NAVC: R48.1 ; port UART2_TX_NAVC
UART3_RX_NAVC: U12.6(TXD) ; port UART3_RX_NAVC
UART3_TX_NAVC: U12.7(RXD) ; port UART3_TX_NAVC
USB_DM_FCC: R53.1 ; port USB_DM_FCC
USB_DM_NAVC: R56.1 ; port USB_DM_NAVC
USB_DP_FCC: R52.1 ; port USB_DP_FCC
USB_DP_NAVC: R55.1 ; port USB_DP_NAVC
USB_ID_FCC: R54.1 ; port USB_ID_FCC
USB_ID_NAVC: R57.1 ; port USB_ID_NAVC
USB_VBUS_FCC: JP1.2(B) ; port USB_VBUS_FCC
USB_VBUS_NAVC: JP2.2(B) ; port USB_VBUS_NAVC
NetC68_2: C68.2 D4.2(A) LED13.2(A) U11.5(VCC) USB3.1(VBUS)
NetC69_2: C69.2 U11.8(V3)
NetC70_2: C70.2 D5.2(A) LED14.2(A) U12.5(VCC) USB4.1(VBUS)
NetC71_2: C71.2 U12.8(V3)
NetD2_1: D2.1(K) FB3.2
NetD2_2: D2.2(A) JP1.1(A) USB1.1(VBUS)
NetD3_1: D3.1(K) FB4.2
NetD3_2: D3.2(A) JP2.1(A) USB2.1(VBUS)
NetD4_1: D4.1(K) FB5.2
NetD5_1: D5.1(K) FB6.2
NetGPS_BAT1_1: GPS_BAT1.1(Pin_1) JP4.3(B)
NetLED13_1: LED13.1(K) R58.2
NetLED14_1: LED14.1(K) R59.2
NetR52_2: R52.2 USB1.3(D+)
NetR53_2: R53.2 USB1.2(D-)
NetR54_2: R54.2 USB1.4(ID)
NetR55_2: R55.2 USB2.3(D+)
NetR56_2: R56.2 USB2.2(D-)
NetR57_2: R57.2 USB2.4(ID)
NetU11_1: U11.1(USB_P) USB3.3(D+)
NetU11_2: U11.2(USB_N) USB3.2(D-)
NetU12_1: U12.1(USB_P) USB4.3(D+)
NetU12_2: U12.2(USB_N) USB4.2(D-)

Not connected (* = marked no-connect by the designer): SWD1 6(Pin_6)* 7(Pin_7)* 8(Pin_8)*; SWD2 6(Pin_6)* 7(Pin_7)* 8(Pin_8)*; U11 4(RTS)*; U12 3(GND) 4(RTS)*; USB3 4(ID)*; USB4 4(ID)*

### Notes on the sheet
- Connections (FCC <-> NAVC)
- UART Connections
- I2C Connections
- (near R43) GPIO Connections
- Connectors (Programming & Debug)
- (near FB6) CH330 UART to USB Converters
- (near R54) USB Programming
- USB Debug
- GPS Backup Battery
- Connector: M50-3600542R
- (near SWD1) Serial Wire Debug
- (near GPS_BAT1) GPS Backup Battery Jumper and Connector
- Labels drawn without touching a wire or pin: GND
- 1
- 2
- 3
- 4
- 5
- 6
- A
- B
- C
- D
- Title: Connections
- File: Connections.kicad_sch
- Sheet: /
- KiCad E.D.A.  kicad (5.1.4)-1
- Size: A4
- Date: 2025-12-29
- Rev: 0.1
- Id: 1/1

### Library data of the parts
C68-C71 = C: Value: 100n; Footprint: Capacitor_SMD:C_0402_1005Metric
D2-D5 = D_Schottky: Value: SD103AWS; Footprint: Diode_SMD:D_SOD-323
FB3-FB6 = Ferrite_Bead_Small-Device: Value: Ferrite_Bead_Small; Footprint: Inductor_SMD:L_0402_1005Metric
JP4 = Jumper_3_Open-Jumper: Value: Jumper_3_Open; Footprint: Jumper:SolderJumper-3_P1.3mm_Open_RoundedPad1.0x1.5mm
LED13 LED14 = LED: Value: G; Footprint: LED_SMD:LED_0603_1608Metric
R40-R59 = R
  R40-R49: Value: 10; Footprint: Resistor_SMD:R_0402_1005Metric
  R50 R51: Value: 0; Footprint: Resistor_SMD:R_0603_1608Metric
  R52 R53 R55 R56: Value: 22; Footprint: Resistor_SMD:R_0402_1005Metric
  R54 R57: Value: 560; Footprint: Resistor_SMD:R_0402_1005Metric
  R58 R59: Value: 560; Footprint: Resistor_SMD:R_0603_1608Metric
U11 U12 = CH330N: USB To Serial Chip; MF: WCH; MP: CH330N; Price: None; Package: Package; Availability: Not in stock; Check_prices: https://www.snapeda.com/parts/CH330N/WCH/view-part/?ref=eda; SnapEDA_Link: https://www.snapeda.com/parts/CH330N/WCH/view-part/?ref=snap; Value: *
USB1-USB4 = USB_B_Micro-Connector: Value: USB_B_Micro; Footprint: Connector_USB:USB_Micro-B_Wuerth_629105150521_CircularHoles
GPS_BAT1 = Conn_01x02: Value: Conn_01x02; Footprint: Connector_Molex:Molex_PicoBlade_53048-0210_1x02_P1.25mm_Horizontal
JP1 JP2 = SolderJumper_2_Open: Value: SolderJumper_2_Open; Footprint: Jumper:SolderJumper-2_P1.3mm_Open_RoundedPad1.0x1.5mm
SWD1 SWD2 = Conn_02x05_Odd_Even: Value: Conn_02x05_Odd_Even; Footprint: Connector_PinHeader_1.27mm:PinHeader_2x05_P1.27mm_Vertical_SMD

## Sheet FCCPeripherals.SchDoc
size 297 x 209 mm
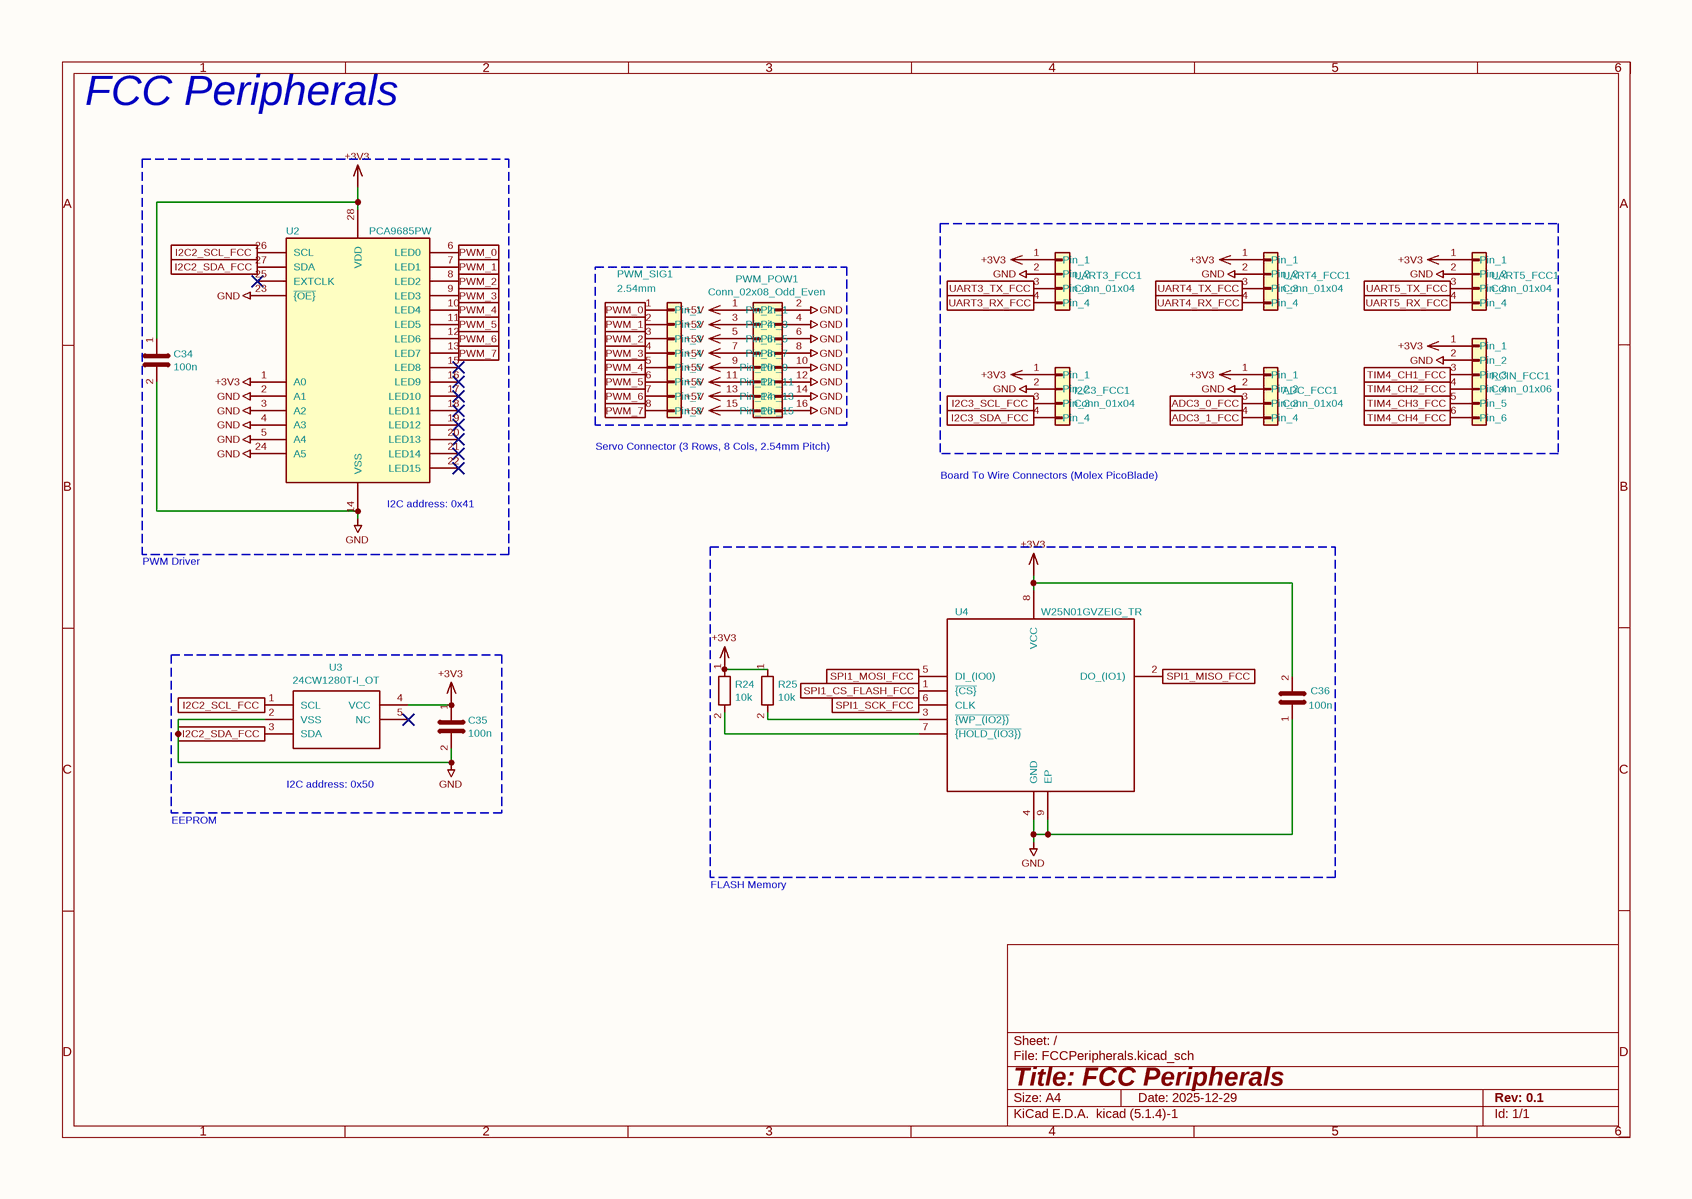
[diagram p4: FCCPeripherals.SchDoc]

### Parts
ADC_FCC1  Conn_01x04  [Molex_PicoBlade_53048-0410_1x04_P1.25mm_Horizontal]
C34  100n  [C_0402_1005Metric]
C35  100n  [C_0402_1005Metric]
C36  100n  [C_0402_1005Metric]
I2C3_FCC1  Conn_01x04  [Molex_PicoBlade_53048-0410_1x04_P1.25mm_Horizontal]
PWM_POW1  Conn_02x08_Odd_Even  [PinHeader_2x08_P2.54mm_Vertical]
PWM_SIG1  2.54mm  [PinHeader_1x08_P2.54mm_Vertical]
R24  10k  [R_0402_1005Metric]
R25  10k  [R_0402_1005Metric]
RCIN_FCC1  Conn_01x06  [Molex_PicoBlade_53048-0610_1x06_P1.25mm_Horizontal]
U2  PCA9685PW  [TSSOP-28_4.4x9.7mm_P0.65mm]
U3  24CW1280T-I_OT  [SOT95P280X145-5N]
U4  W25N01GVZEIG_TR  [SON127P800X600X80-9N-D]
UART3_FCC1  Conn_01x04  [Molex_PicoBlade_53048-0410_1x04_P1.25mm_Horizontal]
UART4_FCC1  Conn_01x04  [Molex_PicoBlade_53048-0410_1x04_P1.25mm_Horizontal]
UART5_FCC1  Conn_01x04  [Molex_PicoBlade_53048-0410_1x04_P1.25mm_Horizontal]

### Blocks framed on the sheet
I2C address: 0x41: C34 U2
I2C address: 0x50: C35 U3

### Ports
ADC3_0_FCC (in), ADC3_1_FCC (in), I2C2_SCL_FCC (in), I2C2_SDA_FCC (in), I2C3_SCL_FCC (in), I2C3_SDA_FCC (in), PWM_0 (in), PWM_1 (in), PWM_2 (in), PWM_3 (in), PWM_4 (in), PWM_5 (in), PWM_6 (in), PWM_7 (in), SPI1_CS_FLASH_FCC (in), SPI1_MISO_FCC (in), SPI1_MOSI_FCC (in), SPI1_SCK_FCC (in), TIM4_CH1_FCC (in), TIM4_CH2_FCC (in), TIM4_CH3_FCC (in), TIM4_CH4_FCC (in), UART3_RX_FCC (in), UART3_TX_FCC (in), UART4_RX_FCC (in), UART4_TX_FCC (in), UART5_RX_FCC (in), UART5_TX_FCC (in)

### Nets
+3V3: ADC_FCC1.1(Pin_1) C34.1 C35.1 C36.2 I2C3_FCC1.1(Pin_1) R24.1 R25.1 RCIN_FCC1.1(Pin_1) U2.1(A0) U2.28(VDD) U3.4(VCC) U4.8(VCC) UART3_FCC1.1(Pin_1) UART4_FCC1.1(Pin_1) UART5_FCC1.1(Pin_1)
+5V: PWM_POW1.1(Pin_1) PWM_POW1.3(Pin_3) PWM_POW1.5(Pin_5) PWM_POW1.7(Pin_7) PWM_POW1.9(Pin_9) PWM_POW1.11(Pin_11) PWM_POW1.13(Pin_13) PWM_POW1.15(Pin_15)
GND: ADC_FCC1.2(Pin_2) C34.2 C35.2 C36.1 I2C3_FCC1.2(Pin_2) PWM_POW1.2(Pin_2) PWM_POW1.4(Pin_4) PWM_POW1.6(Pin_6) PWM_POW1.8(Pin_8) PWM_POW1.10(Pin_10) PWM_POW1.12(Pin_12) PWM_POW1.14(Pin_14) PWM_POW1.16(Pin_16) RCIN_FCC1.2(Pin_2) U2.2(A1) U2.3(A2) U2.4(A3) U2.5(A4) U2.14(VSS) U2.23(~{{OE}}) U2.24(A5) U2.27(SDA) U3.2(VSS) U3.3(SDA) U4.4(GND) U4.9(EP) UART3_FCC1.2(Pin_2) UART4_FCC1.2(Pin_2) UART5_FCC1.2(Pin_2) ; port I2C2_SDA_FCC
ADC3_0_FCC: ADC_FCC1.3(Pin_3) ; port ADC3_0_FCC
ADC3_1_FCC: ADC_FCC1.4(Pin_4) ; port ADC3_1_FCC
I2C2_SCL_FCC: U2.26(SCL) U3.1(SCL) ; port I2C2_SCL_FCC
I2C3_SCL_FCC: I2C3_FCC1.3(Pin_3) ; port I2C3_SCL_FCC
I2C3_SDA_FCC: I2C3_FCC1.4(Pin_4) ; port I2C3_SDA_FCC
PWM_0: PWM_SIG1.1(Pin_1) U2.6(LED0) ; port PWM_0
PWM_1: PWM_SIG1.2(Pin_2) U2.7(LED1) ; port PWM_1
PWM_2: PWM_SIG1.3(Pin_3) U2.8(LED2) ; port PWM_2
PWM_3: PWM_SIG1.4(Pin_4) U2.9(LED3) ; port PWM_3
PWM_4: PWM_SIG1.5(Pin_5) U2.10(LED4) ; port PWM_4
PWM_5: PWM_SIG1.6(Pin_6) U2.11(LED5) ; port PWM_5
PWM_6: PWM_SIG1.7(Pin_7) U2.12(LED6) ; port PWM_6
PWM_7: PWM_SIG1.8(Pin_8) U2.13(LED7) ; port PWM_7
SPI1_CS_FLASH_FCC: U4.1(~{{CS}}) ; port SPI1_CS_FLASH_FCC
SPI1_MISO_FCC: U4.2(DO_(IO1)) ; port SPI1_MISO_FCC
SPI1_MOSI_FCC: U4.5(DI_(IO0)) ; port SPI1_MOSI_FCC
SPI1_SCK_FCC: U4.6(CLK) ; port SPI1_SCK_FCC
TIM4_CH1_FCC: RCIN_FCC1.3(Pin_3) ; port TIM4_CH1_FCC
TIM4_CH2_FCC: RCIN_FCC1.4(Pin_4) ; port TIM4_CH2_FCC
TIM4_CH3_FCC: RCIN_FCC1.5(Pin_5) ; port TIM4_CH3_FCC
TIM4_CH4_FCC: RCIN_FCC1.6(Pin_6) ; port TIM4_CH4_FCC
UART3_RX_FCC: UART3_FCC1.4(Pin_4) ; port UART3_RX_FCC
UART3_TX_FCC: UART3_FCC1.3(Pin_3) ; port UART3_TX_FCC
UART4_RX_FCC: UART4_FCC1.4(Pin_4) ; port UART4_RX_FCC
UART4_TX_FCC: UART4_FCC1.3(Pin_3) ; port UART4_TX_FCC
UART5_RX_FCC: UART5_FCC1.4(Pin_4) ; port UART5_RX_FCC
UART5_TX_FCC: UART5_FCC1.3(Pin_3) ; port UART5_TX_FCC
NetR24_2: R24.2 U4.7(~{{HOLD_(IO3})})
NetR25_2: R25.2 U4.3(~{{WP_(IO2})})

Not connected (* = marked no-connect by the designer): U2 15(LED8)* 16(LED9)* 17(LED10)* 18(LED11)* 19(LED12)* 20(LED13)* 21(LED14)* 22(LED15)* 25(EXTCLK)*; U3 5(NC)*

### Notes on the sheet
- FCC Peripherals
- Servo Connector
  (3 Rows, 8 Cols, 2.54mm Pitch)
- (near I2C3_FCC1) Board To Wire Connectors
  (Molex PicoBlade)
- PWM Driver
- EEPROM
- FLASH Memory
- 1
- 2
- 3
- 4
- 5
- 6
- A
- B
- C
- D
- Title: FCC Peripherals
- File: FCCPeripherals.kicad_sch
- Sheet: /
- KiCad E.D.A.  kicad (5.1.4)-1
- Size: A4
- Date: 2025-12-29
- Rev: 0.1
- Id: 1/1

### Library data of the parts
C34-C36 = C: Value: 100n; Footprint: Capacitor_SMD:C_0402_1005Metric
PWM_SIG1 = Conn_01x08: Value: 2.54mm; Footprint: Connector_PinHeader_2.54mm:PinHeader_1x08_P2.54mm_Vertical
R24 R25 = R: Value: 10k; Footprint: Resistor_SMD:R_0402_1005Metric
U3 = 24CW1280T-I_OT: Manufacturer_Name: Microchip; Manufacturer_Part_Number: 24CW1280T-I/OT; Description: MICROCHIP - 24CW1280T-I/OT - EEPROM, 128KBIT, -40 TO 85DEG C; Height: 1.45; Mouser Part Number: 579-24CW1280T-I/OT; Mouser Price/Stock: https://www.mouser.com/Search/Refine.aspx?Keyword=579-24CW1280T-I%2FOT; RS Part Number: 1871851; RS Price/Stock: http://uk.rs-online.com/web/p/products/1871851; Value: 24CW1280T-I_OT; Footprint: 24CW1280T-I_OT:SOT95P280X145-5N
U4 = W25N01GVZEIG_TR: Manufacturer_Name: Winbond; Manufacturer_Part_Number: W25N01GVZEIG TR; Description: IC FLASH 1GBIT 104MHZ 8WSON; Height: 0.8; Mouser Part Number: 454-W25N01GVZEIGTR; Mouser Price/Stock: https://www.mouser.com/Search/Refine.aspx?Keyword=454-W25N01GVZEIGTR; Value: W25N01GVZEIG_TR; Footprint: W25N01GVZEIG_TR:SON127P800X600X80-9N-D
ADC_FCC1 I2C3_FCC1 UART3_FCC1 UART4_FCC1 UART5_FCC1 = Conn_01x04: Value: Conn_01x04; Footprint: Connector_Molex:Molex_PicoBlade_53048-0410_1x04_P1.25mm_Horizontal
PWM_POW1 = Conn_02x08_Odd_Even: Value: Conn_02x08_Odd_Even; Footprint: Connector_PinHeader_2.54mm:PinHeader_2x08_P2.54mm_Vertical
RCIN_FCC1 = Conn_01x06: Value: Conn_01x06; Footprint: Connector_Molex:Molex_PicoBlade_53048-0610_1x06_P1.25mm_Horizontal
U2 = PCA9685PW: Value: PCA9685PW; Footprint: Package_SO:TSSOP-28_4.4x9.7mm_P0.65mm

## Sheet NAVC.SchDoc
size 297 x 209 mm
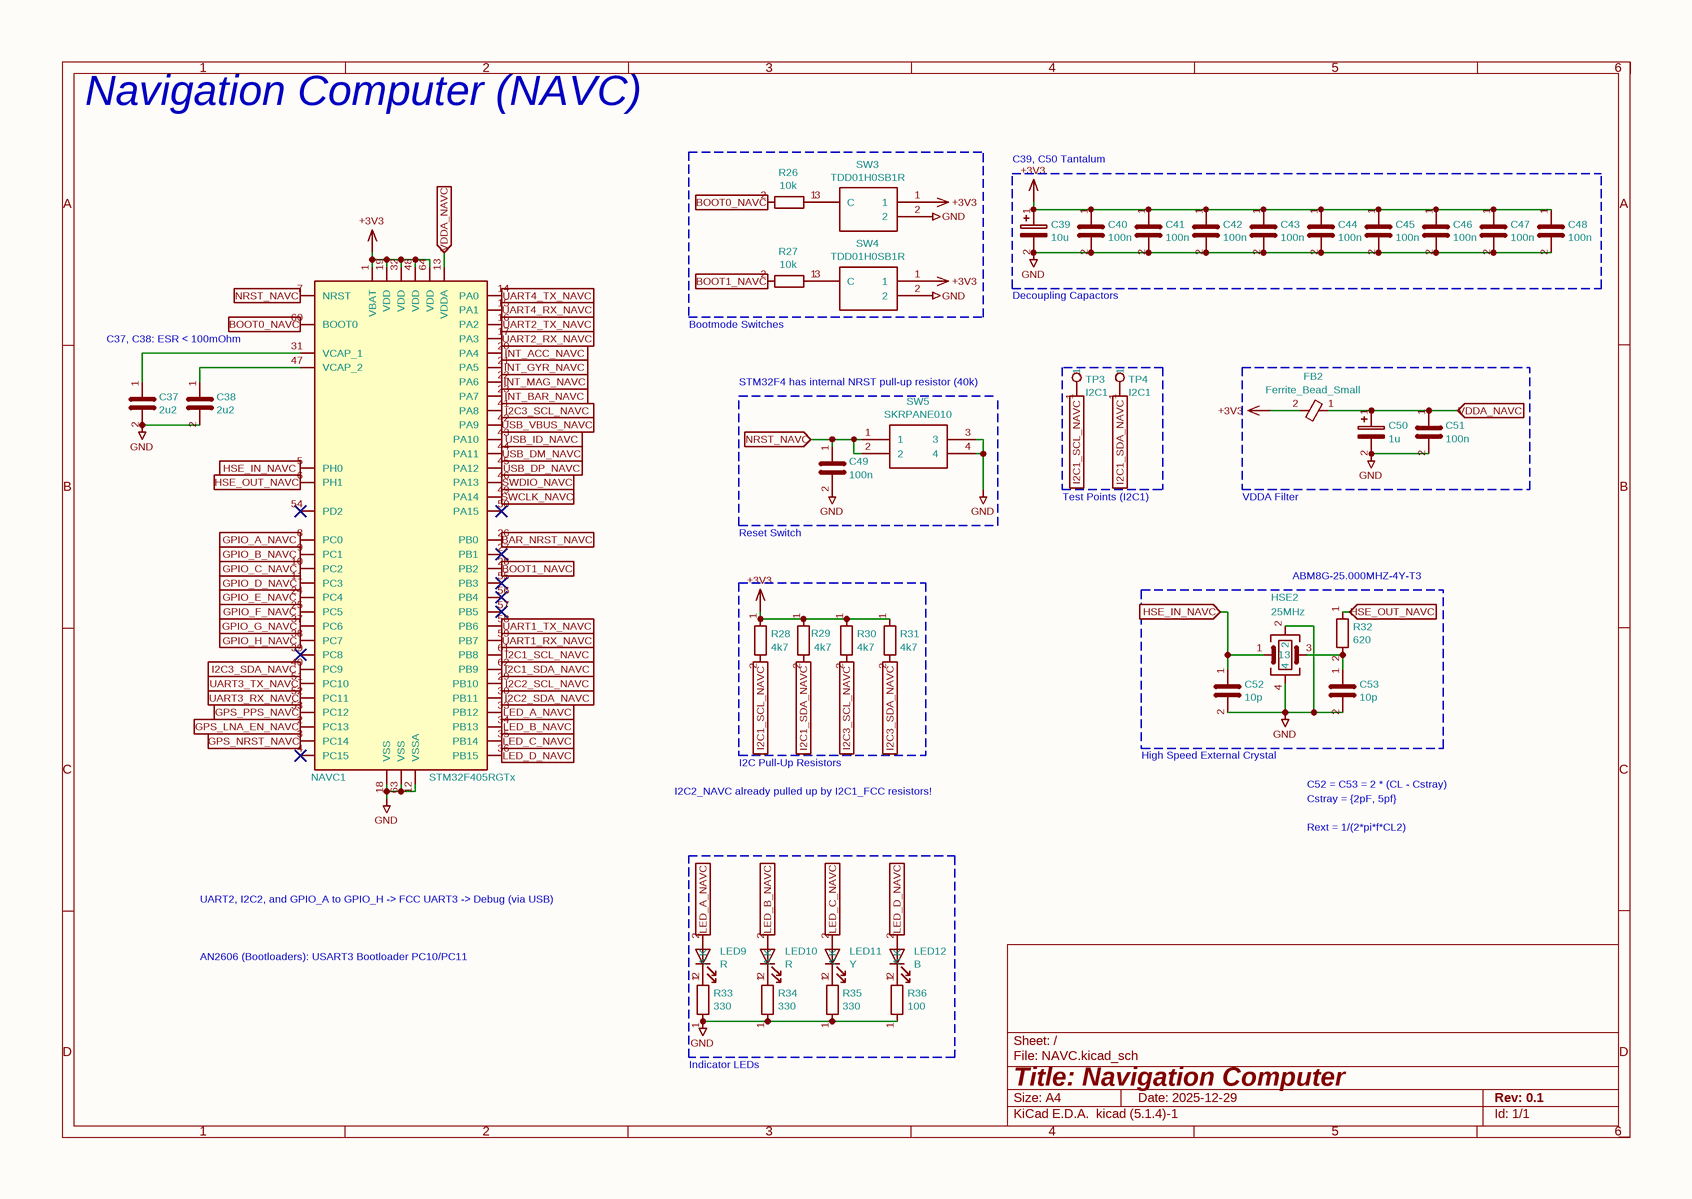
[diagram p5: NAVC.SchDoc]

### Parts
C37  2u2  [C_0603_1608Metric]
C38  2u2  [C_0603_1608Metric]
C39  10u  [C_0603_1608Metric]
C40  100n  [C_0402_1005Metric]
C41  100n  [C_0402_1005Metric]
C42  100n  [C_0402_1005Metric]
C43  100n  [C_0402_1005Metric]
C44  100n  [C_0402_1005Metric]
C45  100n  [C_0402_1005Metric]
C46  100n  [C_0402_1005Metric]
C47  100n  [C_0402_1005Metric]
C48  100n  [C_0402_1005Metric]
C49  100n  [C_0402_1005Metric]
C50  1u  [C_0603_1608Metric]
C51  100n  [C_0402_1005Metric]
C52  10p  [C_0402_1005Metric]
C53  10p  [C_0402_1005Metric]
FB2  Ferrite_Bead_Small  [L_0402_1005Metric]
HSE2  25MHz  [Crystal_SMD_Abracon_ABM8G-4Pin_3.2x2.5mm]
LED9  R  [LED_0603_1608Metric]
LED10  R  [LED_0603_1608Metric]
LED11  Y  [LED_0603_1608Metric]
LED12  B  [LED_0603_1608Metric]
NAVC1  STM32F405RGTx  [LQFP-64_10x10mm_P0.5mm]
R26  10k  [R_0402_1005Metric]
R27  10k  [R_0402_1005Metric]
R28  4k7  [R_0402_1005Metric]
R29  4k7  [R_0402_1005Metric]
R30  4k7  [R_0402_1005Metric]
R31  4k7  [R_0402_1005Metric]
R32  620  [R_0603_1608Metric]
R33  330  [R_0603_1608Metric]
R34  330  [R_0603_1608Metric]
R35  330  [R_0603_1608Metric]
R36  100  [R_0603_1608Metric]
SW3  TDD01H0SB1R  [SOT175P420X230-3N]
SW4  TDD01H0SB1R  [SOT175P420X230-3N]
SW5  SKRPANE010  [SKRPADE010]
TP3  I2C1  [TestPoint_Pad_D1.5mm]
TP4  I2C1  [TestPoint_Pad_D1.5mm]

### Blocks framed on the sheet
C39, C50 Tantalum: C39-C48
STM32F4 has internal / NRST pull-up resistor (40k): C49 SW5
ABM8G-25.000MHZ-4Y-T3: C52 C53 HSE2 R32

### Ports
BAR_NRST_NAVC (in), BOOT0_NAVC (in), BOOT1_NAVC (in), GPIO_A_NAVC (in), GPIO_B_NAVC (in), GPIO_C_NAVC (in), GPIO_D_NAVC (in), GPIO_E_NAVC (in), GPIO_F_NAVC (in), GPIO_G_NAVC (in), GPIO_H_NAVC (in), GPS_LNA_EN_NAVC (in), GPS_NRST_NAVC (in), GPS_PPS_NAVC (in), HSE_IN_NAVC (in), HSE_OUT_NAVC (in), I2C1_SCL_NAVC (in), I2C1_SDA_NAVC (in), I2C2_SCL_NAVC (in), I2C2_SDA_NAVC (in), I2C3_SCL_NAVC (in), I2C3_SDA_NAVC (in), INT_ACC_NAVC (in), INT_BAR_NAVC (in), INT_GYR_NAVC (in), INT_MAG_NAVC (in), LED_A_NAVC (in), LED_B_NAVC (in), LED_C_NAVC (in), LED_D_NAVC (in), NRST_NAVC (in), SWCLK_NAVC (in), SWDIO_NAVC (in), UART1_RX_NAVC (in), UART1_TX_NAVC (in), UART2_RX_NAVC (in), UART2_TX_NAVC (in), UART3_RX_NAVC (in), UART3_TX_NAVC (in), UART4_RX_NAVC (in), UART4_TX_NAVC (in), USB_DM_NAVC (in), USB_DP_NAVC (in), USB_ID_NAVC (in), USB_VBUS_NAVC (in), VDDA_NAVC (in)

### Nets
+3V3: C39.1 C40.1 C41.1 C42.1 C43.1 C44.1 C45.1 C46.1 C47.1 C48.1 FB2.2 NAVC1.1(VBAT) NAVC1.19(VDD) NAVC1.32(VDD) NAVC1.48(VDD) NAVC1.64(VDD) R28.1 R29.1 R30.1 R31.1 SW3.1 SW4.1
GND: C37.2 C38.2 C39.2 C40.2 C41.2 C42.2 C43.2 C44.2 C45.2 C46.2 C47.2 C48.2 C49.2 C50.2 C51.2 C52.2 C53.2 HSE2.2 HSE2.4 NAVC1.12(VSSA) NAVC1.18(VSS) NAVC1.63(VSS) R33.1 R34.1 R35.1 R36.1 SW3.2 SW4.2 SW5.3 SW5.4
BAR_NRST_NAVC: NAVC1.26(PB0) ; port BAR_NRST_NAVC
BOOT0_NAVC: NAVC1.60(BOOT0) R26.2 ; port BOOT0_NAVC
BOOT1_NAVC: NAVC1.28(PB2) R27.2 ; port BOOT1_NAVC
GPIO_A_NAVC: NAVC1.8(PC0) ; port GPIO_A_NAVC
GPIO_B_NAVC: NAVC1.9(PC1) ; port GPIO_B_NAVC
GPIO_C_NAVC: NAVC1.10(PC2) ; port GPIO_C_NAVC
GPIO_D_NAVC: NAVC1.11(PC3) ; port GPIO_D_NAVC
GPIO_E_NAVC: NAVC1.24(PC4) ; port GPIO_E_NAVC
GPIO_F_NAVC: NAVC1.25(PC5) ; port GPIO_F_NAVC
GPIO_G_NAVC: NAVC1.37(PC6) ; port GPIO_G_NAVC
GPIO_H_NAVC: NAVC1.38(PC7) ; port GPIO_H_NAVC
GPS_LNA_EN_NAVC: NAVC1.2(PC13) ; port GPS_LNA_EN_NAVC
GPS_NRST_NAVC: NAVC1.3(PC14) ; port GPS_NRST_NAVC
GPS_PPS_NAVC: NAVC1.53(PC12) ; port GPS_PPS_NAVC
HSE_IN_NAVC: C52.1 HSE2.1 NAVC1.5(PH0) ; port HSE_IN_NAVC
HSE_OUT_NAVC: NAVC1.6(PH1) R32.1 ; port HSE_OUT_NAVC
I2C1_SCL_NAVC: NAVC1.61(PB8) R28.2 TP3.1 ; port I2C1_SCL_NAVC
I2C1_SDA_NAVC: NAVC1.62(PB9) R29.2 TP4.1 ; port I2C1_SDA_NAVC
I2C2_SCL_NAVC: NAVC1.29(PB10) ; port I2C2_SCL_NAVC
I2C2_SDA_NAVC: NAVC1.30(PB11) ; port I2C2_SDA_NAVC
I2C3_SCL_NAVC: NAVC1.41(PA8) R30.2 ; port I2C3_SCL_NAVC
I2C3_SDA_NAVC: NAVC1.40(PC9) R31.2 ; port I2C3_SDA_NAVC
INT_ACC_NAVC: NAVC1.20(PA4) ; port INT_ACC_NAVC
INT_BAR_NAVC: NAVC1.23(PA7) ; port INT_BAR_NAVC
INT_GYR_NAVC: NAVC1.21(PA5) ; port INT_GYR_NAVC
INT_MAG_NAVC: NAVC1.22(PA6) ; port INT_MAG_NAVC
LED_A_NAVC: LED9.2(A) NAVC1.33(PB12) ; port LED_A_NAVC
LED_B_NAVC: LED10.2(A) NAVC1.34(PB13) ; port LED_B_NAVC
LED_C_NAVC: LED11.2(A) NAVC1.35(PB14) ; port LED_C_NAVC
LED_D_NAVC: LED12.2(A) NAVC1.36(PB15) ; port LED_D_NAVC
NRST_NAVC: C49.1 NAVC1.7(NRST) SW5.1 SW5.2 ; port NRST_NAVC
SWCLK_NAVC: NAVC1.49(PA14) ; port SWCLK_NAVC
SWDIO_NAVC: NAVC1.46(PA13) ; port SWDIO_NAVC
UART1_RX_NAVC: NAVC1.59(PB7) ; port UART1_RX_NAVC
UART1_TX_NAVC: NAVC1.58(PB6) ; port UART1_TX_NAVC
UART2_RX_NAVC: NAVC1.17(PA3) ; port UART2_RX_NAVC
UART2_TX_NAVC: NAVC1.16(PA2) ; port UART2_TX_NAVC
UART3_RX_NAVC: NAVC1.52(PC11) ; port UART3_RX_NAVC
UART3_TX_NAVC: NAVC1.51(PC10) ; port UART3_TX_NAVC
UART4_RX_NAVC: NAVC1.15(PA1) ; port UART4_RX_NAVC
UART4_TX_NAVC: NAVC1.14(PA0) ; port UART4_TX_NAVC
USB_DM_NAVC: NAVC1.44(PA11) ; port USB_DM_NAVC
USB_DP_NAVC: NAVC1.45(PA12) ; port USB_DP_NAVC
USB_ID_NAVC: NAVC1.43(PA10) ; port USB_ID_NAVC
USB_VBUS_NAVC: NAVC1.42(PA9) ; port USB_VBUS_NAVC
VDDA_NAVC: C50.1 C51.1 FB2.1 NAVC1.13(VDDA) ; port VDDA_NAVC
NetC37_1: C37.1 NAVC1.31(VCAP_1)
NetC38_1: C38.1 NAVC1.47(VCAP_2)
NetC53_1: C53.1 HSE2.3 R32.2
NetLED9_1: LED9.1(K) R33.2
NetLED10_1: LED10.1(K) R34.2
NetLED11_1: LED11.1(K) R35.2
NetLED12_1: LED12.1(K) R36.2
NetR26_1: R26.1 SW3.3(C)
NetR27_1: R27.1 SW4.3(C)

Not connected (* = marked no-connect by the designer): NAVC1 4(PC15)* 27(PB1)* 39(PC8)* 50(PA15)* 54(PD2)* 55(PB3)* 56(PB4)* 57(PB5)*

### Notes on the sheet
- Navigation Computer (NAVC)
- C37, C38: ESR < 100mOhm
- (near R27) Bootmode Switches
- Decoupling Capactors
- Test Points (I2C1)
- VDDA Filter
- Reset Switch
- I2C2_NAVC already pulled up by I2C1_FCC resistors!
- I2C Pull-Up Resistors
- High Speed External Crystal
- C52 = C53 = 2 * (CL - Cstray)
- Rext = 1/(2*pi*f*CL2)
- Cstray = {2pF, 5pf}
- UART2, I2C2, and GPIO_A to GPIO_H -> FCC
  UART3 -> Debug (via USB)
- AN2606 (Bootloaders): USART3 Bootloader PC10/PC11
- Indicator LEDs
- 1
- 2
- 3
- 4
- 5
- 6
- A
- B
- C
- D
- Title: Navigation Computer
- File: NAVC.kicad_sch
- Sheet: /
- KiCad E.D.A.  kicad (5.1.4)-1
- Size: A4
- Date: 2025-12-29
- Rev: 0.1
- Id: 1/1

### Library data of the parts
C37 C38 C40-C49 C51-C53 = C
  C37 C38: Value: 2u2; Footprint: Capacitor_SMD:C_0603_1608Metric
  C40-C49 C51: Value: 100n; Footprint: Capacitor_SMD:C_0402_1005Metric
  C52 C53: Value: 10p; Footprint: Capacitor_SMD:C_0402_1005Metric
C39 C50 = CP-Device: Footprint: Capacitor_SMD:C_0603_1608Metric
  C39: Value: 10u
  C50: Value: 1u
FB2 = Ferrite_Bead_Small-Device: Value: Ferrite_Bead_Small; Footprint: Inductor_SMD:L_0402_1005Metric
HSE2 = Crystal_GND24: Value: 25MHz; Footprint: Crystal:Crystal_SMD_Abracon_ABM8G-4Pin_3.2x2.5mm
LED9-LED12 = LED: Footprint: LED_SMD:LED_0603_1608Metric
  LED9 LED10: Value: R
  LED11: Value: Y
  LED12: Value: B
NAVC1 = STM32F405RGTx-MCU_ST_STM32F4: Value: STM32F405RGTx; Footprint: Package_QFP:LQFP-64_10x10mm_P0.5mm
R26-R36 = R
  R26 R27: Value: 10k; Footprint: Resistor_SMD:R_0402_1005Metric
  R28-R31: Value: 4k7; Footprint: Resistor_SMD:R_0402_1005Metric
  R32: Value: 620; Footprint: Resistor_SMD:R_0603_1608Metric
  R33-R35: Value: 330; Footprint: Resistor_SMD:R_0603_1608Metric
  R36: Value: 100; Footprint: Resistor_SMD:R_0603_1608Metric
SW3 SW4 = TDD01H0SB1R: Manufacturer_Name: C & K COMPONENTS; Height: 2.3; Manufacturer_Part_Number: TDD01H0SB1R; Mouser Part Number: 611-TDD01H0SB1R; Mouser Price/Stock: https://www.mouser.com/Search/Refine.aspx?Keyword=611-TDD01H0SB1R; Value: TDD01H0SB1R; Footprint: TDD01H0SB1R:SOT175P420X230-3N
SW5 = SKRPANE010: Manufacturer_Name: ALPS; Height: 2; Manufacturer_Part_Number: SKRPANE010; Mouser Part Number: 688-SKRPANE010; Mouser Price/Stock: https://www.mouser.com/Search/Refine.aspx?Keyword=688-SKRPANE010; Value: SKRPANE010; Footprint: SKRPANE010:SKRPADE010
TP3 TP4 = TestPoint: Value: I2C1; Footprint: TestPoint:TestPoint_Pad_D1.5mm

## Nets that join several sheets
+3V3: Flight Controller 2 (6 pins), FCC (26 pins), NAVCPeripherals (32 pins), Connections (JP4.1 SWD1.1 SWD2.1), FCCPeripherals (15 pins), NAVC (22 pins)
+5V: Flight Controller 2 (9 pins), Connections (FB3.1 FB4.1 FB5.1 FB6.1), FCCPeripherals (8 pins)
GND: Flight Controller 2 (27 pins), FCC (40 pins), NAVCPeripherals (30 pins), Connections (22 pins), FCCPeripherals (29 pins), NAVC (30 pins)
ADC3_0_FCC: FCC (FCC1.17), FCCPeripherals (ADC_FCC1.3)
ADC3_1_FCC: FCC (FCC1.18), FCCPeripherals (ADC_FCC1.4)
BAR_NRST_NAVC: NAVCPeripherals (R37.2 U7.8), NAVC (NAVC1.26)
GPIO_A_FCC: FCC (FCC1.81), Connections (R40.2)
GPIO_A_NAVC: Connections (R40.1), NAVC (NAVC1.8)
GPIO_B_FCC: FCC (FCC1.82), Connections (R41.2)
GPIO_B_NAVC: Connections (R41.1), NAVC (NAVC1.9)
GPIO_C_FCC: FCC (FCC1.83), Connections (R42.2)
GPIO_C_NAVC: Connections (R42.1), NAVC (NAVC1.10)
GPIO_D_FCC: FCC (FCC1.84), Connections (R43.2)
GPIO_D_NAVC: Connections (R43.1), NAVC (NAVC1.11)
GPIO_E_FCC: FCC (FCC1.85), Connections (R44.2)
GPIO_E_NAVC: Connections (R44.1), NAVC (NAVC1.24)
GPIO_F_FCC: FCC (FCC1.86), Connections (R45.2)
GPIO_F_NAVC: Connections (R45.1), NAVC (NAVC1.25)
GPIO_G_FCC: FCC (FCC1.87), Connections (R46.2)
GPIO_G_NAVC: Connections (R46.1), NAVC (NAVC1.37)
GPIO_H_FCC: FCC (FCC1.88), Connections (R47.2)
GPIO_H_NAVC: Connections (R47.1), NAVC (NAVC1.38)
GPS_BAT_BACKUP: NAVCPeripherals (U10.6), Connections (JP4.2)
GPS_LNA_EN_NAVC: NAVCPeripherals (GPS_NAVC1.7 U10.13), NAVC (NAVC1.2)
GPS_NRST_NAVC: NAVCPeripherals (GPS_NAVC1.6 R38.2 U10.9), NAVC (NAVC1.3)
GPS_PPS_NAVC: NAVCPeripherals (GPS_NAVC1.5 U10.4), NAVC (NAVC1.53)
I2C1_SCL_FCC: FCC (FCC1.92 R9.2 TP1.1), Connections (R50.2)
I2C1_SCL_NAVC: NAVCPeripherals (5 pins), NAVC (NAVC1.61 R28.2 TP3.1)
I2C1_SDA_FCC: FCC (FCC1.93 R10.2 TP2.1), Connections (R51.2)
I2C1_SDA_NAVC: NAVCPeripherals (5 pins), NAVC (NAVC1.62 R29.2 TP4.1)
I2C2_SCL_FCC: Flight Controller 2 (U1.5), FCC (FCC1.46 R11.2), FCCPeripherals (U2.26 U3.1)
I2C2_SCL_NAVC: Connections (R50.1), NAVC (NAVC1.29)
I2C2_SDA_NAVC: Connections (R51.1), NAVC (NAVC1.30)
I2C3_SCL_FCC: FCC (FCC1.67 R13.2), FCCPeripherals (I2C3_FCC1.3)
I2C3_SCL_NAVC: NAVCPeripherals (I2C3_NAVC1.3), NAVC (NAVC1.41 R30.2)
I2C3_SDA_FCC: FCC (FCC1.66 R14.2), FCCPeripherals (I2C3_FCC1.4)
I2C3_SDA_NAVC: NAVCPeripherals (I2C3_NAVC1.4), NAVC (NAVC1.40 R31.2)
INT_ACC_NAVC: NAVCPeripherals (U5.16), NAVC (NAVC1.20)
INT_BAR_NAVC: NAVCPeripherals (U7.9), NAVC (NAVC1.23)
INT_GYR_NAVC: NAVCPeripherals (U5.12), NAVC (NAVC1.21)
INT_MAG_NAVC: NAVCPeripherals (U8.7), NAVC (NAVC1.22)
NRST_FCC: FCC (C31.1 FCC1.14 SW1.1 SW1.2), Connections (SWD1.10)
NRST_NAVC: Connections (SWD2.10), NAVC (C49.1 NAVC1.7 SW5.1 SW5.2)
SPI1_CS_FLASH_FCC: FCC (FCC1.28), FCCPeripherals (U4.1)
SPI1_MISO_FCC: FCC (FCC1.30), FCCPeripherals (U4.2)
SPI1_MOSI_FCC: FCC (FCC1.31), FCCPeripherals (U4.5)
SPI1_SCK_FCC: FCC (FCC1.29), FCCPeripherals (U4.6)
SWCLK_FCC: FCC (FCC1.76), Connections (SWD1.4)
SWCLK_NAVC: Connections (SWD2.4), NAVC (NAVC1.49)
SWDIO_FCC: FCC (FCC1.72), Connections (SWD1.2)
SWDIO_NAVC: Connections (SWD2.2), NAVC (NAVC1.46)
TIM4_CH1_FCC: FCC (FCC1.59), FCCPeripherals (RCIN_FCC1.3)
TIM4_CH2_FCC: FCC (FCC1.60), FCCPeripherals (RCIN_FCC1.4)
TIM4_CH3_FCC: FCC (FCC1.61), FCCPeripherals (RCIN_FCC1.5)
TIM4_CH4_FCC: FCC (FCC1.62), FCCPeripherals (RCIN_FCC1.6)
UART1_RX_FCC: FCC (FCC1.54), Connections (U11.6)
UART1_RX_NAVC: NAVCPeripherals (GPS_NAVC1.4 U10.2), NAVC (NAVC1.59)
UART1_TX_FCC: FCC (FCC1.53), Connections (U11.7)
UART1_TX_NAVC: NAVCPeripherals (GPS_NAVC1.3 U10.3), NAVC (NAVC1.58)
UART2_RX_FCC: FCC (FCC1.25), Connections (R48.2)
UART2_RX_NAVC: Connections (R49.1), NAVC (NAVC1.17)
UART2_TX_FCC: FCC (FCC1.24), Connections (R49.2)
UART2_TX_NAVC: Connections (R48.1), NAVC (NAVC1.16)
UART3_RX_FCC: FCC (FCC1.56), FCCPeripherals (UART3_FCC1.4)
UART3_RX_NAVC: Connections (U12.6), NAVC (NAVC1.52)
UART3_TX_FCC: FCC (FCC1.55), FCCPeripherals (UART3_FCC1.3)
UART3_TX_NAVC: Connections (U12.7), NAVC (NAVC1.51)
UART4_RX_FCC: FCC (FCC1.23), FCCPeripherals (UART4_FCC1.4)
UART4_RX_NAVC: NAVCPeripherals (UART4_NAVC1.4), NAVC (NAVC1.15)
UART4_TX_FCC: FCC (FCC1.22), FCCPeripherals (UART4_FCC1.3)
UART4_TX_NAVC: NAVCPeripherals (UART4_NAVC1.3), NAVC (NAVC1.14)
UART5_RX_FCC: FCC (FCC1.51), FCCPeripherals (UART5_FCC1.4)
UART5_TX_FCC: FCC (FCC1.52), FCCPeripherals (UART5_FCC1.3)
USB_DM_FCC: FCC (FCC1.70), Connections (R53.1)
USB_DM_NAVC: Connections (R56.1), NAVC (NAVC1.44)
USB_DP_FCC: FCC (FCC1.71), Connections (R52.1)
USB_DP_NAVC: Connections (R55.1), NAVC (NAVC1.45)
USB_ID_FCC: FCC (FCC1.69), Connections (R54.1)
USB_ID_NAVC: Connections (R57.1), NAVC (NAVC1.43)
USB_VBUS_FCC: FCC (FCC1.68), Connections (JP1.2)
USB_VBUS_NAVC: Connections (JP2.2), NAVC (NAVC1.42)